# Altium project FMB.PrjPcb
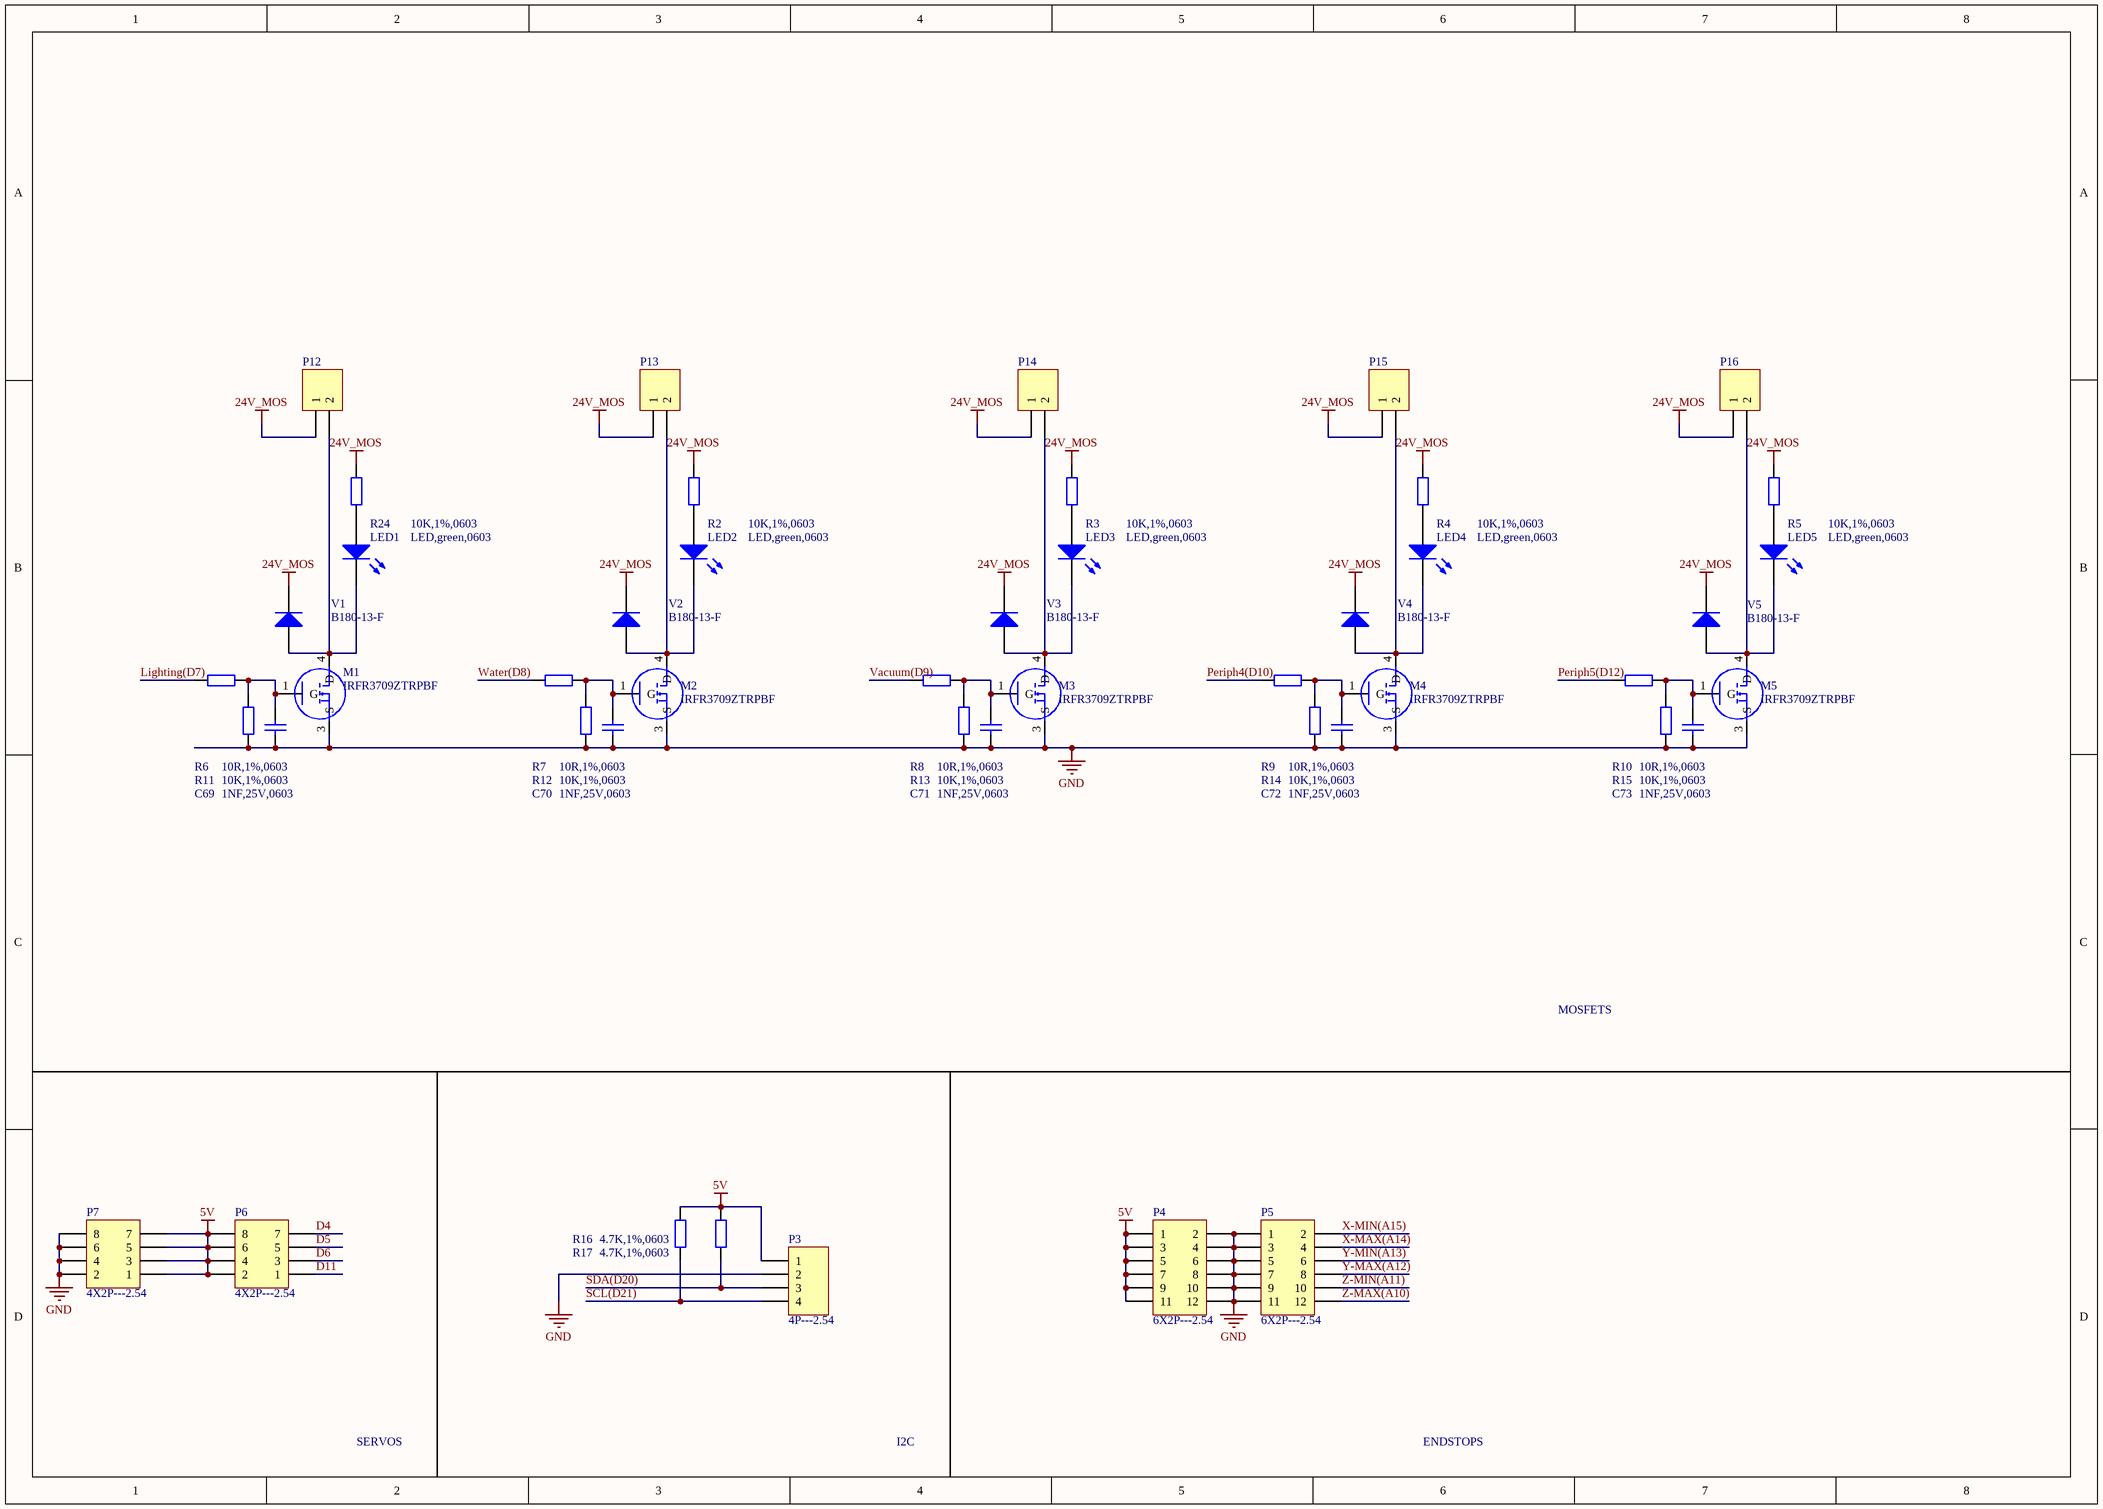
[diagram p0: FMB_MOS.SchDoc]
7 sheets, 272 parts. Net scope: global (net labels, ports and power ports of the same name join across sheets).
Board file: FMB-Farmduino.PcbDoc
Sheets:
  FMB_MOS.SchDoc
  FMB-AB.SchDoc
  FMB-MCU.SchDoc
  FMB-MOTOR.SchDoc
  FMB-POWER.SchDoc
  FMB-STM32.SchDoc
  FMB-USB.SchDoc

## Sheet FMB_MOS.SchDoc
size A3

### Parts
C69  1NF,25V,0603  [RC0603]
C70  1NF,25V,0603  [RC0603]
C71  1NF,25V,0603  [RC0603]
C72  1NF,25V,0603  [RC0603]
C73  1NF,25V,0603  [RC0603]
LED1  LED,green,0603  [LED-0603]
LED2  LED,green,0603  [LED-0603]
LED3  LED,green,0603  [LED-0603]
LED4  LED,green,0603  [LED-0603]
LED5  LED,green,0603  [LED-0603]
M1  IRFR3709ZTRPBF  [DPAK]
M2  IRFR3709ZTRPBF  [DPAK]
M3  IRFR3709ZTRPBF  [DPAK]
M4  IRFR3709ZTRPBF  [DPAK]
M5  IRFR3709ZTRPBF  [DPAK]
P3  4P---2.54  [HDR1X4]
P4  6X2P---2.54  [HDR2X6]
P5  6X2P---2.54  [HDR2X6]
P6  4X2P---2.54  [HDR2X4]
P7  4X2P---2.54  [HDR2X4]
P12  Molex 151048-1206  [151048]  (value not drawn)
P13  Molex 151048-1206  [151048]  (value not drawn)
P14  Molex 151048-1206  [151048]  (value not drawn)
P15  Molex 151048-1206  [151048]  (value not drawn)
P16  Molex 151048-1206  [151048]  (value not drawn)
R2  10K,1%,0603  [RC0603]
R3  10K,1%,0603  [RC0603]
R4  10K,1%,0603  [RC0603]
R5  10K,1%,0603  [RC0603]
R6  10R,1%,0603  [RC0603]
R7  10R,1%,0603  [RC0603]
R8  10R,1%,0603  [RC0603]
R9  10R,1%,0603  [RC0603]
R10  10R,1%,0603  [RC0603]
R11  10K,1%,0603  [RC0603]
R12  10K,1%,0603  [RC0603]
R13  10K,1%,0603  [RC0603]
R14  10K,1%,0603  [RC0603]
R15  10K,1%,0603  [RC0603]
R16  4.7K,1%,0603  [RC0603]
R17  4.7K,1%,0603  [RC0603]
R24  10K,1%,0603  [RC0603]
V1  B180-13-F  [SMA]
V2  B180-13-F  [SMA]
V3  B180-13-F  [SMA]
V4  B180-13-F  [SMA]
V5  B180-13-F  [SMA]

### Nets
5V: P3.1 P4.1 P4.3 P4.5 P4.7 P4.9 P4.11 P6.2 P6.4 P6.6 P6.8 P7.1 P7.3 P7.5 P7.7 R16.2 R17.2
24V_MOS: P12.1 P13.1 P14.1 P15.1 P16.1 R2.1 R3.1 R4.1 R5.1 R24.1 V1.2(K) V2.2(K) V3.2(K) V4.2(K) V5.2(K)  [project net 24V]
GND: C69.1 C70.1 C71.1 C72.1 C73.1 M1.3(S) M2.3(S) M3.3(S) M4.3(S) M5.3(S) P3.2 P4.2 P4.4 P4.6 P4.8 P4.10 P4.12 P5.1 P5.3 P5.5 P5.7 P5.9 P5.11 P7.2 P7.4 P7.6 P7.8 R11.1 R12.1 R13.2 R14.1 R15.1
D4: P6.7
D5: P6.5
D6: P6.3
D11: P6.1
Lighting(D7): R6.1
Periph4(D10): R9.1
Periph5(D12): R10.1
SCL(D21): P3.4 R16.1
SDA(D20): P3.3 R17.1
Vacuum(D9): R8.1
Water(D8): R7.1
X-MAX(A14): P5.4
X-MIN(A15): P5.2
Y-MAX(A12): P5.8
Y-MIN(A13): P5.6
Z-MAX(A10): P5.12
Z-MIN(A11): P5.10
NetC69_2: C69.2 M1.1(G) R6.2 R11.2
NetC70_2: C70.2 M2.1(G) R7.2 R12.2
NetC71_2: C71.2 M3.1(G) R8.2 R13.1
NetC72_2: C72.2 M4.1(G) R9.2 R14.2
NetC73_2: C73.2 M5.1(G) R10.2 R15.2
NetLED1_1: LED1.1(A) R24.2
NetLED1_2: LED1.2(K) M1.4(D) P12.2 V1.1(A)
NetLED2_1: LED2.1(A) R2.2
NetLED2_2: LED2.2(K) M2.4(D) P13.2 V2.1(A)
NetLED3_1: LED3.1(A) R3.2
NetLED3_2: LED3.2(K) M3.4(D) P14.2 V3.1(A)
NetLED4_1: LED4.1(A) R4.2
NetLED4_2: LED4.2(K) M4.4(D) P15.2 V4.1(A)
NetLED5_1: LED5.1(A) R5.2
NetLED5_2: LED5.2(K) M5.4(D) P16.2 V5.1(A)

### Notes on the sheet
- MOSFETS
- SERVOS
- I2C
- ENDSTOPS

### Library data of the parts
C69-C73 = Cap: Capacitor; Value: 100pF; Published: 8-Jun-2000; LatestRevisionDate: 17-Jul-2002; LatestRevisionNote: Re-released for DXP Platform.; PackageReference: RAD-0.3; Publisher: Altium Limited; PackageDescription: Radial Cap, Thru-Hole; 2 Leads; 0.3 in Pin Spacing
LED1-LED5 = LED0: Typical INFRARED GaAs LED; Published: 8-Jun-2000; LatestRevisionDate: 08-Jul-2005; LatestRevisionNote: Mech Layer 1 removed.; PackageReference: LED-0; Publisher: Altium Limited; PackageDescription: LED; 2 Leads
M1-M5 = AP94T07
P3 = Header 4: Header, 4-Pin; LatestRevisionDate: 17-Jul-2002; LatestRevisionNote: Re-released for DXP Platform.; Publisher: Altium Limited
P4 P5 = Header 6X2: Header, 6-Pin, Dual row; LatestRevisionDate: 17-Jul-2002; LatestRevisionNote: Re-released for DXP Platform.; Publisher: Altium Limited
P6 P7 = Header 4X2: Header, 4-Pin, Dual row; LatestRevisionDate: 17-Jul-2002; LatestRevisionNote: Re-released for DXP Platform.; Publisher: Altium Limited
P12-P16 = Header 2: Header, 2-Pin; LatestRevisionDate: 17-Jul-2002; LatestRevisionNote: Re-released for DXP Platform.; Publisher: Altium Limited
R2-R17 R24 = Res2: Resistor; Value: 1K; Published: 8-Jun-2000; LatestRevisionDate: 17-Jul-2002; LatestRevisionNote: Re-released for DXP Platform.; PackageReference: AXIAL-0.4; Publisher: Altium Limited; PackageDescription: Axial Device, Thru-Hole; 2 Leads; 0.4 in Pin Spacing
V1-V5 = Diode: Default Diode; Published: 8-Jun-2000; LatestRevisionDate: 17-Jul-2002; LatestRevisionNote: Re-released for DXP Platform.; PackageVersion: Sep-1996; PackageReference: SMC; Publisher: Altium Limited; PackageDescription: DO-214-AB/SMC; 2 C-Bend Leads; Body 7.9 x 5.9 mm, inc. leads (LxW); Code_JEDEC: DO-214-AB

## Sheet FMB-AB.SchDoc
size A4
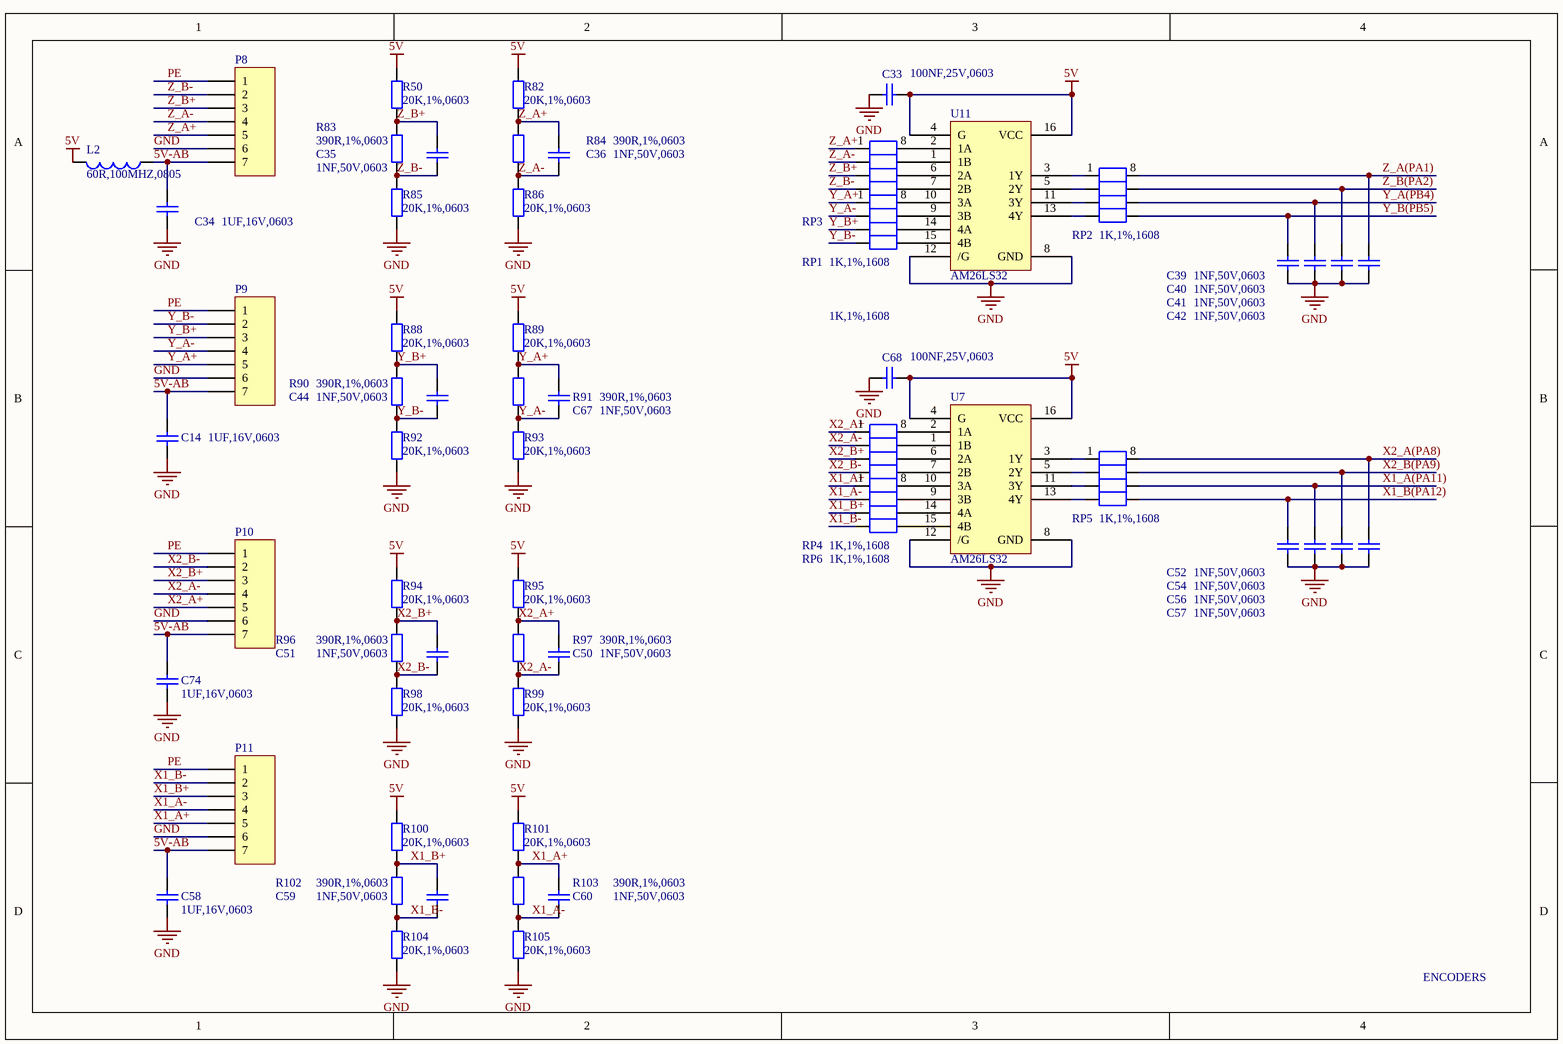
[diagram p1: FMB-AB.SchDoc]

### Parts
C14  1UF,16V,0603  [RC0603]
C33  100NF,25V,0603  [RC0603]
C34  1UF,16V,0603  [RC0603]
C35  1NF,50V,0603  [RC0603]
C36  1NF,50V,0603  [RC0603]
C39  1NF,50V,0603  [RC0603]
C40  1NF,50V,0603  [RC0603]
C41  1NF,50V,0603  [RC0603]
C42  1NF,50V,0603  [RC0603]
C44  1NF,50V,0603  [RC0603]
C50  1NF,50V,0603  [RC0603]
C51  1NF,50V,0603  [RC0603]
C52  1NF,50V,0603  [RC0603]
C54  1NF,50V,0603  [RC0603]
C56  1NF,50V,0603  [RC0603]
C57  1NF,50V,0603  [RC0603]
C58  1UF,16V,0603  [RC0603]
C59  1NF,50V,0603  [RC0603]
C60  1NF,50V,0603  [RC0603]
C67  1NF,50V,0603  [RC0603]
C68  100NF,25V,0603  [RC0603]
C74  1UF,16V,0603  [RC0603]
L2  60R,100MHZ,0805  [RC0805]
P8  Header 7  [DIP-1*7-2.54]  (value not drawn)
P9  Header 7  [DIP-1*7-2.54]  (value not drawn)
P10  Header 7  [DIP-1*7-2.54]  (value not drawn)
P11  Header 7  [DIP-1*7-2.54]  (value not drawn)
R50  20K,1%,0603  [RC0603]
R82  20K,1%,0603  [RC0603]
R83  390R,1%,0603  [RC0603]
R84  390R,1%,0603  [RC0603]
R85  20K,1%,0603  [RC0603]
R86  20K,1%,0603  [RC0603]
R88  20K,1%,0603  [RC0603]
R89  20K,1%,0603  [RC0603]
R90  390R,1%,0603  [RC0603]
R91  390R,1%,0603  [RC0603]
R92  20K,1%,0603  [RC0603]
R93  20K,1%,0603  [RC0603]
R94  20K,1%,0603  [RC0603]
R95  20K,1%,0603  [RC0603]
R96  390R,1%,0603  [RC0603]
R97  390R,1%,0603  [RC0603]
R98  20K,1%,0603  [RC0603]
R99  20K,1%,0603  [RC0603]
R100  20K,1%,0603  [RC0603]
R101  20K,1%,0603  [RC0603]
R102  390R,1%,0603  [RC0603]
R103  390R,1%,0603  [RC0603]
R104  20K,1%,0603  [RC0603]
R105  20K,1%,0603  [RC0603]
RP1  1K,1%,1608  [RP1608]
RP2  1K,1%,1608  [RP1608]
RP3  1K,1%,1608  [RP1608]
RP4  1K,1%,1608  [RP1608]
RP5  1K,1%,1608  [RP1608]
RP6  1K,1%,1608  [RP1608]
U7  AM26LS32  [SO-16-H]
U11  AM26LS32  [SO-16-H]

### Nets
5V: C33.1 C68.1 L2.2 R50.1 R82.1 R88.1 R89.1 R94.1 R95.1 R100.1 R101.1 U7.4(G) U7.16(VCC) U11.4(G) U11.16(VCC)
GND: C14.2 C33.2 C34.2 C39.1 C40.1 C41.1 C42.1 C52.1 C54.1 C56.1 C57.1 C58.2 C68.2 C74.2 P8.6 P9.6 P10.6 P11.6 R85.2 R86.2 R92.2 R93.2 R98.2 R99.2 R104.2 R105.2 U7.8(GND) U7.12(/G) U11.8(GND) U11.12(/G)
5V-AB: C14.1 C34.1 C58.1 C74.1 L2.1 P8.7 P9.7 P10.7 P11.7
PE: P8.1 P9.1 P10.1 P11.1
X1_A(PA11): C52.2 RP5.6
X1_A+: C60.2 P11.5 R101.2 R103.1 RP6.1
X1_A-: C60.1 P11.4 R103.2 R105.1 RP6.2
X1_B(PA12): C54.2 RP5.5
X1_B+: C59.2 P11.3 R100.2 R102.1 RP6.3
X1_B-: C59.1 P11.2 R102.2 R104.1 RP6.4
X2_A(PA8): C57.2 RP5.8
X2_A+: C50.2 P10.5 R95.2 R97.1 RP4.1
X2_A-: C50.1 P10.4 R97.2 R99.1 RP4.2
X2_B(PA9): C56.2 RP5.7
X2_B+: C51.2 P10.3 R94.2 R96.1 RP4.3
X2_B-: C51.1 P10.2 R96.2 R98.1 RP4.4
Y_A(PB4): C39.2 RP2.6
Y_A+: C67.2 P9.5 R89.2 R91.1 RP3.1
Y_A-: C67.1 P9.4 R91.2 R93.1 RP3.2
Y_B(PB5): C40.2 RP2.5
Y_B+: C44.2 P9.3 R88.2 R90.1 RP3.3
Y_B-: C44.1 P9.2 R90.2 R92.1 RP3.4
Z_A(PA1): C42.2 RP2.8
Z_A+: C36.2 P8.5 R82.2 R84.1 RP1.1
Z_A-: C36.1 P8.4 R84.2 R86.1 RP1.2
Z_B(PA2): C41.2 RP2.7
Z_B+: C35.2 P8.3 R50.2 R83.1 RP1.3
Z_B-: C35.1 P8.2 R83.2 R85.1 RP1.4
NetRP1_5: RP1.5 U11.7(2B)
NetRP1_6: RP1.6 U11.6(2A)
NetRP1_7: RP1.7 U11.1(1B)
NetRP1_8: RP1.8 U11.2(1A)
NetRP2_1: RP2.1 U11.3(1Y)
NetRP2_2: RP2.2 U11.5(2Y)
NetRP2_3: RP2.3 U11.11(3Y)
NetRP2_4: RP2.4 U11.13(4Y)
NetRP3_5: RP3.5 U11.15(4B)
NetRP3_6: RP3.6 U11.14(4A)
NetRP3_7: RP3.7 U11.9(3B)
NetRP3_8: RP3.8 U11.10(3A)
NetRP4_5: RP4.5 U7.7(2B)
NetRP4_6: RP4.6 U7.6(2A)
NetRP4_7: RP4.7 U7.1(1B)
NetRP4_8: RP4.8 U7.2(1A)
NetRP5_1: RP5.1 U7.3(1Y)
NetRP5_2: RP5.2 U7.5(2Y)
NetRP5_3: RP5.3 U7.11(3Y)
NetRP5_4: RP5.4 U7.13(4Y)
NetRP6_5: RP6.5 U7.15(4B)
NetRP6_6: RP6.6 U7.14(4A)
NetRP6_7: RP6.7 U7.9(3B)
NetRP6_8: RP6.8 U7.10(3A)

### Notes on the sheet
- ENCODERS

### Library data of the parts
C14 C33-C36 C39-C42 C44 C50-C52 C54 C56-C60 C67 C68 C74 = Cap: Capacitor; Value: 100pF; Published: 8-Jun-2000; LatestRevisionDate: 17-Jul-2002; LatestRevisionNote: Re-released for DXP Platform.; PackageReference: RAD-0.3; Publisher: Altium Limited; PackageDescription: Radial Cap, Thru-Hole; 2 Leads; 0.3 in Pin Spacing
L2 = Inductor: Code_IEC: 1005; Value: 10mH; Published: 8-Jun-2000; LatestRevisionDate: 29-May-2009; LatestRevisionNote: IPC-7351 Footprint Added.; PackageReference: 0402-A; Publisher: Altium Limited; PackageDescription: Chip Inductor; Code_JEITA: 0402
P8-P11 = Header 7: Header, 7-Pin; LatestRevisionDate: 17-Jul-2002; LatestRevisionNote: Re-released for DXP Platform.; Publisher: Altium Limited
R50 R82-R86 R88-R105 = Res2: Resistor; Value: 1K; Published: 8-Jun-2000; LatestRevisionDate: 17-Jul-2002; LatestRevisionNote: Re-released for DXP Platform.; PackageReference: AXIAL-0.4; Publisher: Altium Limited; PackageDescription: Axial Device, Thru-Hole; 2 Leads; 0.4 in Pin Spacing
RP1-RP6 = RP1608-1

## Sheet FMB-MCU.SchDoc
size A3
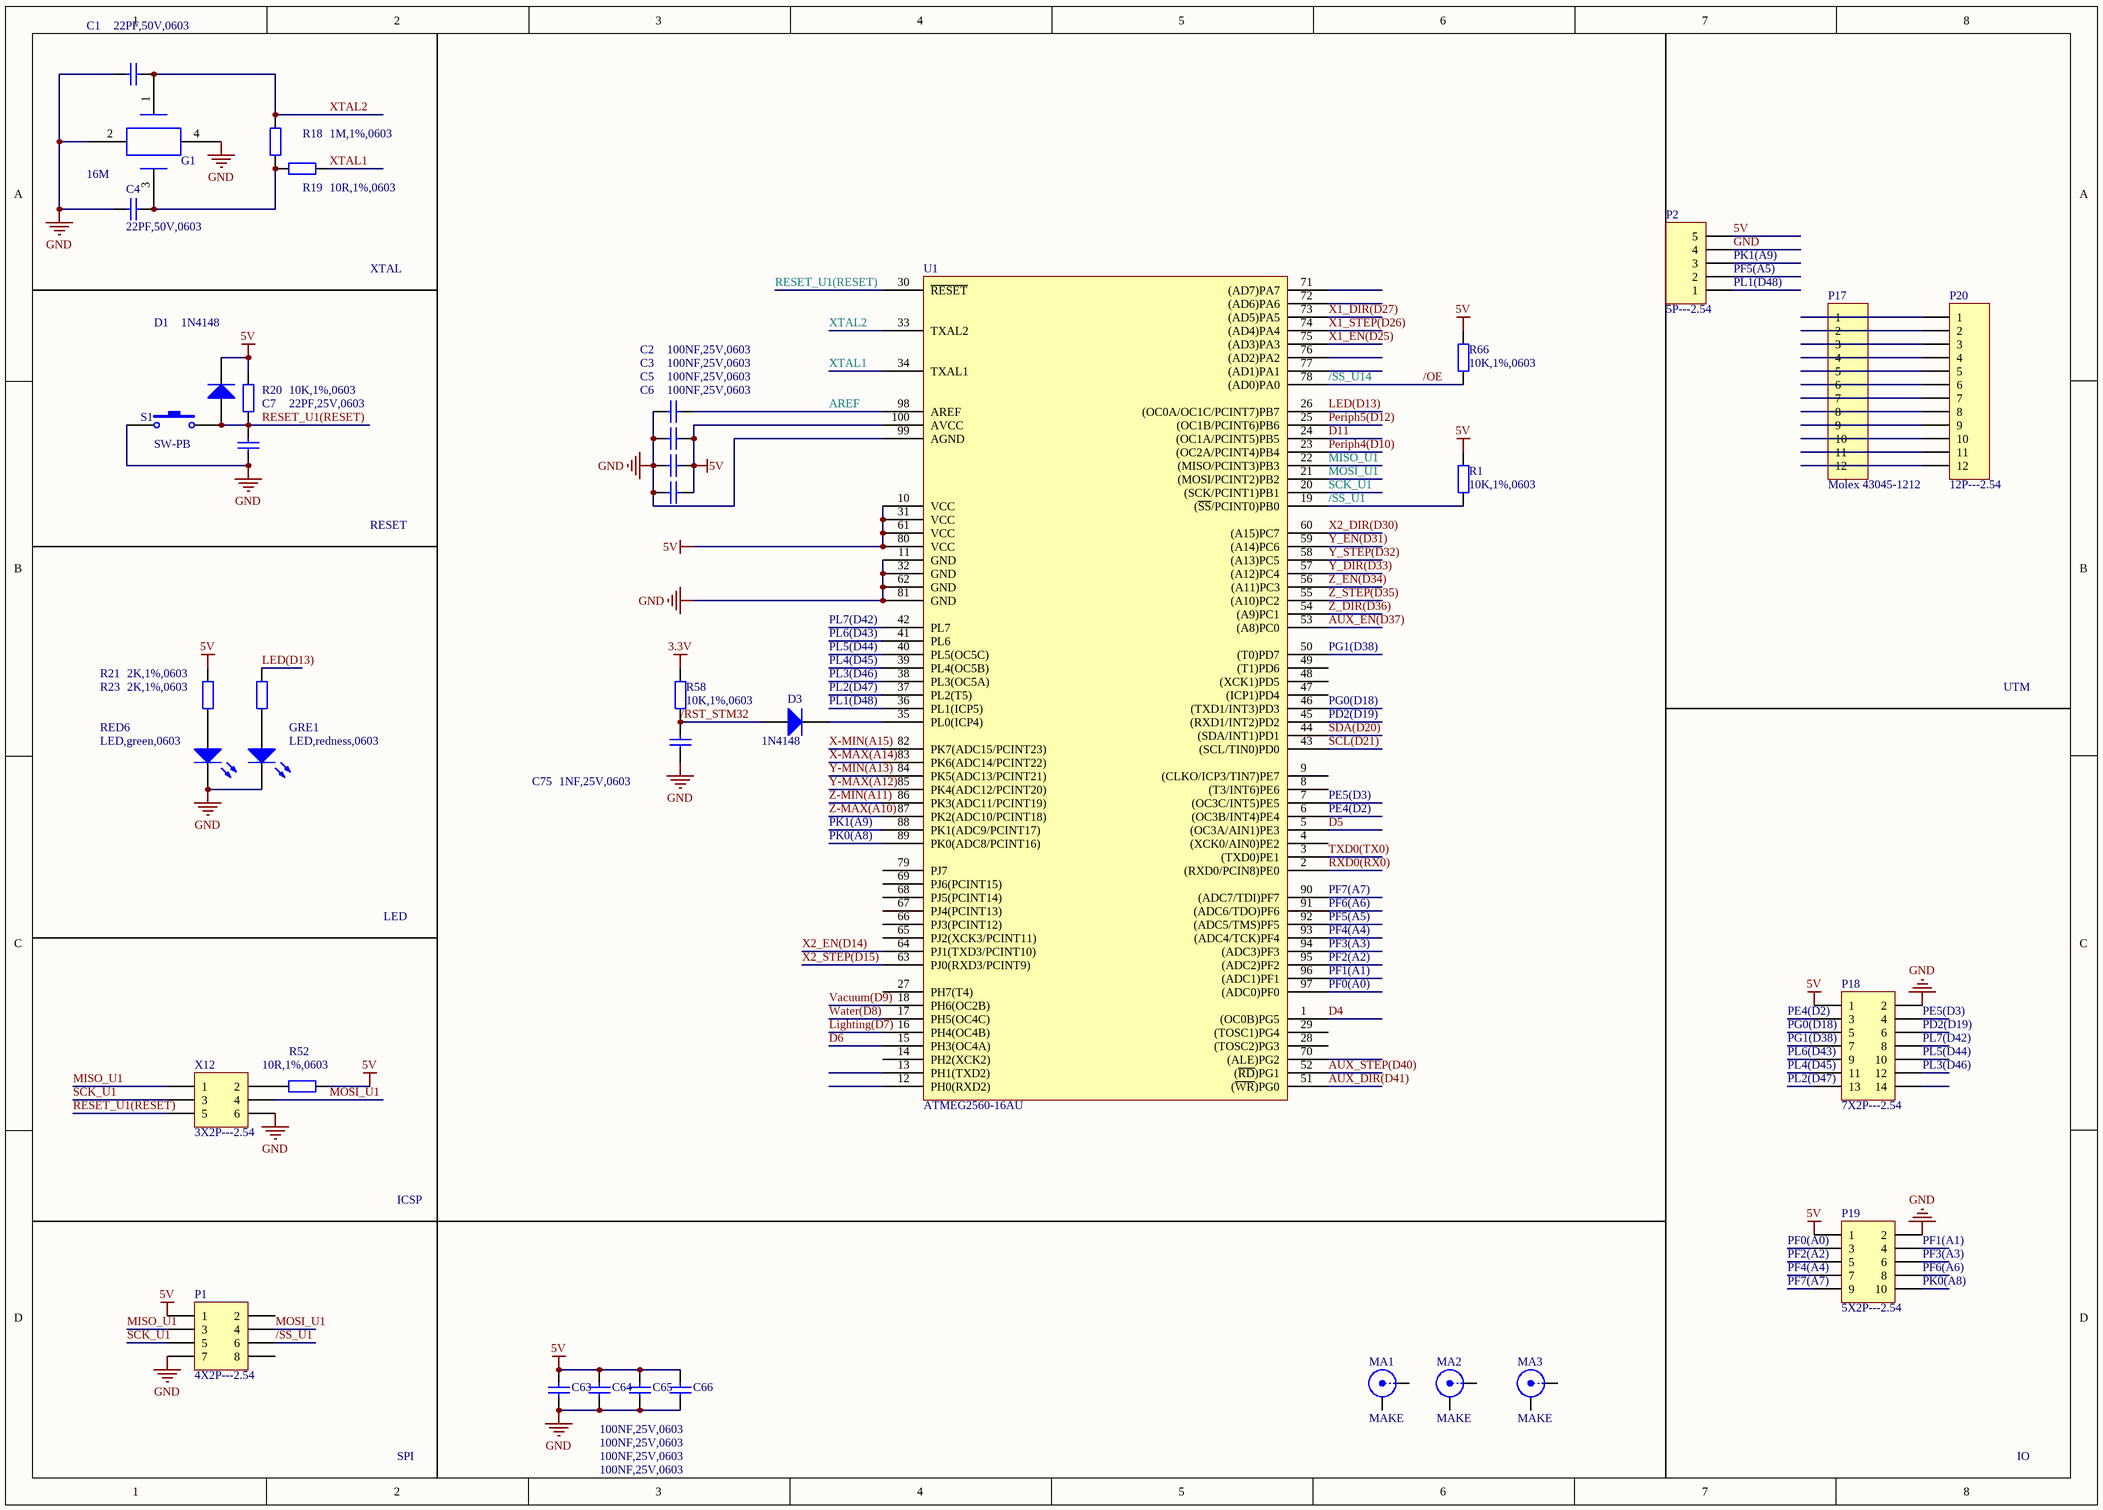
[diagram p2: FMB-MCU.SchDoc]

### Parts
C1  22PF,50V,0603  [RC0603]
C2  100NF,25V,0603  [RC0603]
C3  100NF,25V,0603  [RC0603]
C4  22PF,50V,0603  [RC0603]
C5  100NF,25V,0603  [RC0603]
C6  100NF,25V,0603  [RC0603]
C7  22PF,25V,0603  [RC0603]
C63  100NF,25V,0603  [RC0603]
C64  100NF,25V,0603  [RC0603]
C65  100NF,25V,0603  [RC0603]
C66  100NF,25V,0603  [RC0603]
C75  1NF,25V,0603  [RC0603]
D1  1N4148  [SOD-323]
D3  1N4148  [SOD-323]
G1  16M  [Y-3225]
GRE1  LED,redness,0603  [LED-0603]
MA1  MAKE
MA2  MAKE
MA3  MAKE
P1  4X2P---2.54  [HDR2X4]
P2  5P---2.54  [HDR1X5]
P17  Molex 43045-1212  [43045-1212]
P18  7X2P---2.54  [HDR2X7]
P19  5X2P---2.54  [HDR2X5]
P20  12P---2.54  [HDR1X12]
R1  10K,1%,0603  [RC0603]
R18  1M,1%,0603  [RC0603]
R19  10R,1%,0603  [RC0603]
R20  10K,1%,0603  [RC0603]
R21  2K,1%,0603  [RC0603]
R23  2K,1%,0603  [RC0603]
R52  10R,1%,0603  [RC0603]
R58  10K,1%,0603  [RC0603]
R66  10K,1%,0603  [RC0603]
RED6  LED,green,0603  [LED-0603]
S1  SW-PB  [DIP6*6]
U1  ATMEG2560-16AU  [LQFP-100]
X12  3X2P---2.54  [HDR2X3]

### Nets
3.3V: R58.1
5V: C3.1 C5.1 C6.1 C63.1 C64.1 C65.1 C66.1 D1.2(K) P1.1 P2.5 P18.1 P19.1 R1.2 R20.1 R23.1 R52.1 R66.2 U1.10(VCC) U1.31(VCC) U1.61(VCC) U1.80(VCC) U1.100(AVCC)
GND: C1.2 C2.2 C3.2 C4.1 C5.2 C6.2 C7.2 C63.2 C64.2 C65.2 C66.2 C75.1 G1.2 G1.4 GRE1.2(K) P1.7 P2.4 P18.2 P19.2 RED6.2(K) S1.1 U1.11(GND) U1.32(GND) U1.62(GND) U1.81(GND) U1.99(AGND) X12.6
/OE: R66.1 U1.78((AD0)PA0)  [also labelled /SS_U14]
/RST_STM32: C75.2 D3.1(A) R58.2
/SS_U1: P1.6 R1.1 U1.19((~{SS}/PCINT0)PB0)
AREF: C2.1 U1.98(AREF)
AUX_DIR(D41): U1.51((~{WR})PG0)
AUX_EN(D37): U1.53((A8)PC0)
AUX_STEP(D40): U1.52((~{RD})PG1)
D4: U1.1((OC0B)PG5)
D5: U1.5((OC3A/AIN1)PE3)
D6: U1.15(PH3(OC4A))
D11: U1.24((OC1A/PCINT5)PB5)
LED(D13): R21.1 U1.26((OC0A/OC1C/PCINT7)PB7)
Lighting(D7): U1.16(PH4(OC4B))
MISO_U1: P1.3 U1.22((MISO/PCINT3)PB3) X12.1
MOSI_U1: P1.4 U1.21((MOSI/PCINT2)PB2) X12.4
PD2(D19): P18.6 U1.45((RXD1/INT2)PD2)
PE4(D2): P18.3 U1.6((OC3B/INT4)PE4)
PE5(D3): P18.4 U1.7((OC3C/INT5)PE5)
Periph4(D10): U1.23((OC2A/PCINT4)PB4)
Periph5(D12): U1.25((OC1B/PCINT6)PB6)
PF0(A0): P19.3 U1.97((ADC0)PF0)
PF1(A1): P19.4 U1.96((ADC1)PF1)
PF2(A2): P19.5 U1.95((ADC2)PF2)
PF3(A3): P19.6 U1.94((ADC3)PF3)
PF4(A4): P19.7 U1.93((ADC4/TCK)PF4)
PF5(A5): P2.2 U1.92((ADC5/TMS)PF5)
PF6(A6): P19.8 U1.91((ADC6/TDO)PF6)
PF7(A7): P19.9 U1.90((ADC7/TDI)PF7)
PG0(D18): P18.5 U1.46((TXD1/INT3)PD3)
PG1(D38): P18.7 U1.50((T0)PD7)
PK0(A8): P19.10 U1.89(PK0(ADC8/PCINT16))
PK1(A9): P2.3 U1.88(PK1(ADC9/PCINT17))
PL1(D48): P2.1 U1.36(PL1(ICP5))
PL2(D47): P18.13 U1.37(PL2(T5))
PL3(D46): P18.12 U1.38(PL3(OC5A))
PL4(D45): P18.11 U1.39(PL4(OC5B))
PL5(D44): P18.10 U1.40(PL5(OC5C))
PL6(D43): P18.9 U1.41(PL6)
PL7(D42): P18.8 U1.42(PL7)
RESET_U1(RESET): C7.1 D1.1(A) R20.2 S1.2 U1.30(~{RESET}) X12.5
RXD0(RX0): U1.2((RXD0/PCIN8)PE0)
SCK_U1: P1.5 U1.20((SCK/PCINT1)PB1) X12.3
SCL(D21): U1.43((SCL/TIN0)PD0)
SDA(D20): U1.44((SDA/INT1)PD1)
TXD0(TX0): U1.3((TXD0)PE1)
Vacuum(D9): U1.18(PH6(OC2B))
Water(D8): U1.17(PH5(OC4C))
X1_DIR(D27): U1.73((AD5)PA5)
X1_EN(D25): U1.75((AD3)PA3)
X1_STEP(D26): U1.74((AD4)PA4)
X2_DIR(D30): U1.60((A15)PC7)
X2_EN(D14): U1.64(PJ1(TXD3/PCINT10))
X2_STEP(D15): U1.63(PJ0(RXD3/PCINT9))
X-MAX(A14): U1.83(PK6(ADC14/PCINT22))
X-MIN(A15): U1.82(PK7(ADC15/PCINT23))
XTAL1: R19.2 U1.34(TXAL1)
XTAL2: C1.1 G1.1 R18.1 U1.33(TXAL2)
Y-MAX(A12): U1.85(PK4(ADC12/PCINT20))
Y-MIN(A13): U1.84(PK5(ADC13/PCINT21))
Y_DIR(D33): U1.57((A12)PC4)
Y_EN(D31): U1.59((A14)PC6)
Y_STEP(D32): U1.58((A13)PC5)
Z-MAX(A10): U1.87(PK2(ADC10/PCINT18))
Z-MIN(A11): U1.86(PK3(ADC11/PCINT19))
Z_DIR(D36): U1.54((A9)PC1)
Z_EN(D34): U1.56((A11)PC3)
Z_STEP(D35): U1.55((A10)PC2)
NetC4_2: C4.2 G1.3 R18.2 R19.1
NetD3_2: D3.2(K) U1.35(PL0(ICP4))
NetGRE1_1: GRE1.1(A) R21.2
NetP17_1: P17.1 P20.1
NetP17_2: P17.2 P20.2
NetP17_3: P17.3 P20.3
NetP17_4: P17.4 P20.4
NetP17_5: P17.5 P20.5
NetP17_6: P17.6 P20.6
NetP17_7: P17.7 P20.7
NetP17_8: P17.8 P20.8
NetP17_9: P17.9 P20.9
NetP17_10: P17.10 P20.10
NetP17_11: P17.11 P20.11
NetP17_12: P17.12 P20.12
NetR23_2: R23.2 RED6.1(A)
NetR52_2: R52.2 X12.2

Not connected (* = marked no-connect by the designer): MA1 1(X) 2(Y); MA2 1(X) 2(Y); MA3 1(X) 2(Y); P1 2 8; P18 14; U1 4((XCK0/AIN0)PE2) 8((T3/INT6)PE6) 9((CLKO/ICP3/TIN7)PE7) 12(PH0(RXD2)) 13(PH1(TXD2)) 14(PH2(XCK2)) 27(PH7(T4)) 28((TOSC2)PG3) 29((TOSC1)PG4) 47((ICP1)PD4) 48((XCK1)PD5) 49((T1)PD6) 65(PJ2(XCK3/PCINT11)) 66(PJ3(PCINT12)) 67(PJ4(PCINT13)) 68(PJ5(PCINT14)) 69(PJ6(PCINT15)) 70((ALE)PG2) 71((AD7)PA7) 72((AD6)PA6) 76((AD2)PA2) 77((AD1)PA1) 79(PJ7)

### Notes on the sheet
- XTAL
- RESET
- UTM
- LED
- ICSP
- SPI
- IO

### Library data of the parts
C1-C7 C63-C66 C75 = Cap: Capacitor; Value: 100pF; Published: 8-Jun-2000; LatestRevisionDate: 17-Jul-2002; LatestRevisionNote: Re-released for DXP Platform.; PackageReference: RAD-0.3; Publisher: Altium Limited; PackageDescription: Radial Cap, Thru-Hole; 2 Leads; 0.3 in Pin Spacing
D1 D3 = Diode: Default Diode; Published: 8-Jun-2000; LatestRevisionDate: 17-Jul-2002; LatestRevisionNote: Re-released for DXP Platform.; PackageVersion: Sep-1996; PackageReference: SMC; Publisher: Altium Limited; PackageDescription: DO-214-AB/SMC; 2 C-Bend Leads; Body 7.9 x 5.9 mm, inc. leads (LxW); Code_JEDEC: DO-214-AB
G1 = G
GRE1 RED6 = LED0: Typical INFRARED GaAs LED; Published: 8-Jun-2000; LatestRevisionDate: 08-Jul-2005; LatestRevisionNote: Mech Layer 1 removed.; PackageReference: LED-0; Publisher: Altium Limited; PackageDescription: LED; 2 Leads
MA1-MA3 = BNC: BNC Elbow Connector; LatestRevisionDate: 17-Jul-2002; LatestRevisionNote: Re-released for DXP Platform.; Publisher: Altium Limited
P1 = Header 4X2: Header, 4-Pin, Dual row; LatestRevisionDate: 17-Jul-2002; LatestRevisionNote: Re-released for DXP Platform.; Publisher: Altium Limited
P2 = Header 5: Header, 5-Pin; LatestRevisionDate: 17-Jul-2002; LatestRevisionNote: Re-released for DXP Platform.; Publisher: Altium Limited
P17 P20 = Header 12: Header, 12-Pin; LatestRevisionDate: 17-Jul-2002; LatestRevisionNote: Re-released for DXP Platform.; Publisher: Altium Limited
P18 = Header 7X2: Header, 7-Pin, Dual row; LatestRevisionDate: 17-Jul-2002; LatestRevisionNote: Re-released for DXP Platform.; Publisher: Altium Limited
P19 = Header 5X2: Header, 5-Pin, Dual row; LatestRevisionDate: 17-Jul-2002; LatestRevisionNote: Re-released for DXP Platform.; Publisher: Altium Limited
R1 R18-R21 R23 R52 R58 R66 = Res2: Resistor; Value: 1K; Published: 8-Jun-2000; LatestRevisionDate: 17-Jul-2002; LatestRevisionNote: Re-released for DXP Platform.; PackageReference: AXIAL-0.4; Publisher: Altium Limited; PackageDescription: Axial Device, Thru-Hole; 2 Leads; 0.4 in Pin Spacing
S1 = SW-PB: Switch; Published: 24-Mar-1999; LatestRevisionDate: 17-Jul-2002; LatestRevisionNote: Re-released for DXP Platform.; PackageReference: SPST-2; Publisher: Altium Limited; PackageDescription: Switch; 2 Leads
X12 = Header 3X2: Header, 3-Pin, Dual row; LatestRevisionDate: 17-Jul-2002; LatestRevisionNote: Re-released for DXP Platform.; Publisher: Altium Limited

## Sheet FMB-MOTOR.SchDoc
size A4
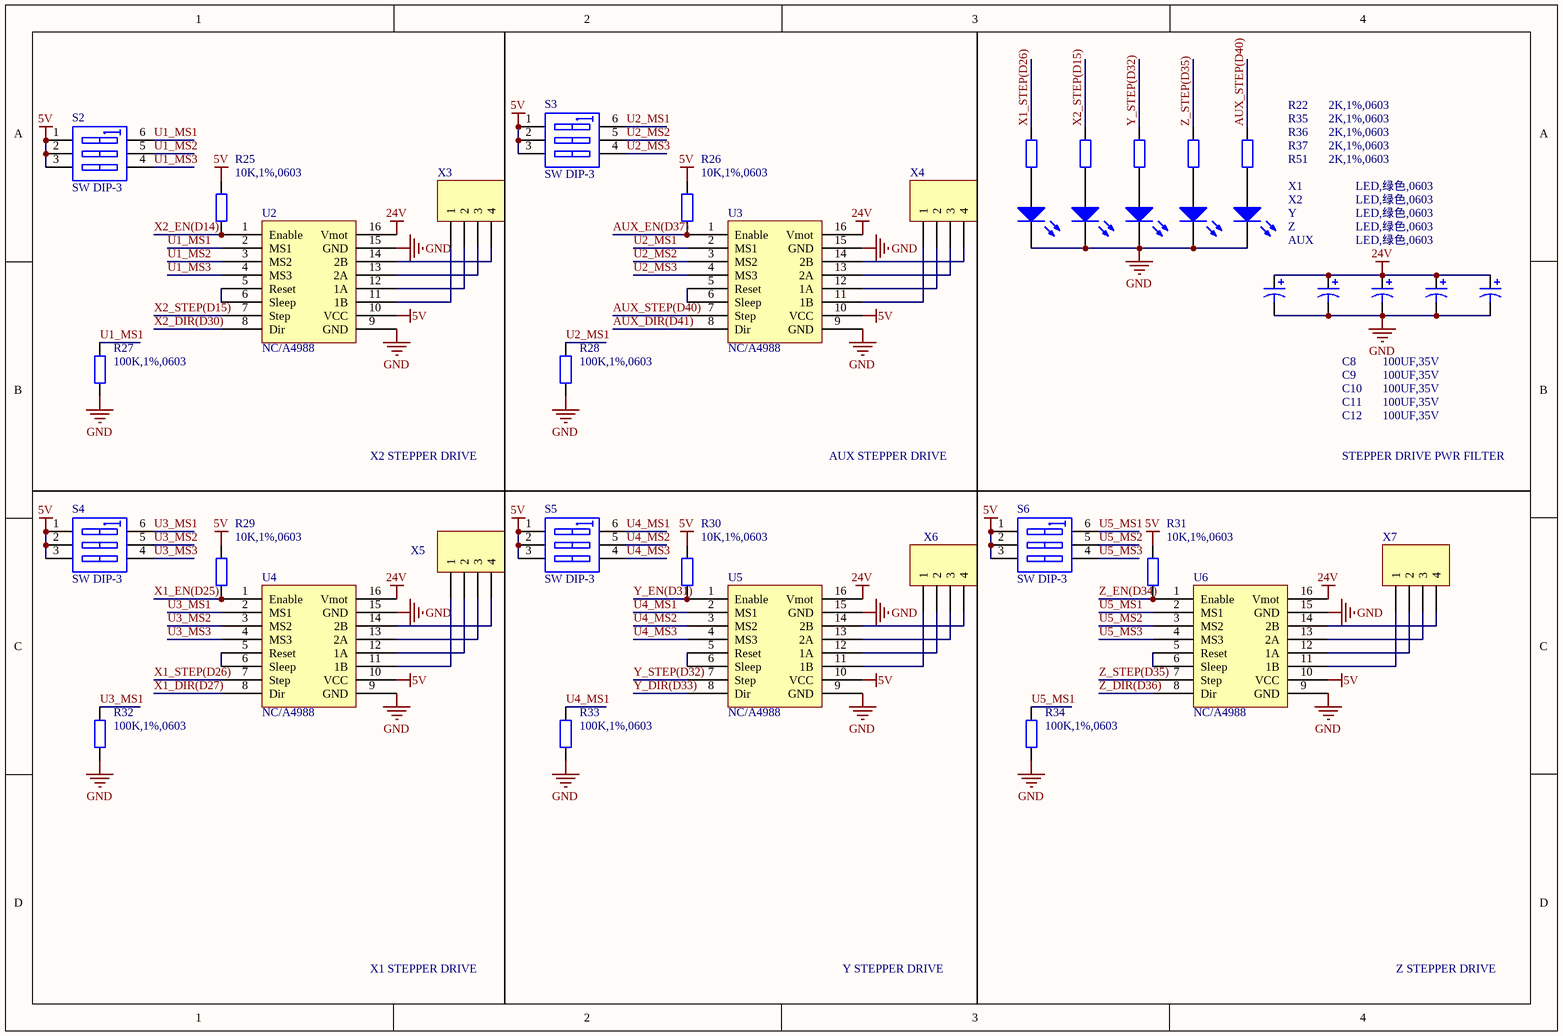
[diagram p3: FMB-MOTOR.SchDoc]

### Parts
AUX  LED,绿色,0603  [LED-0603]
C8  100UF,35V  [EC-5X5.3]
C9  100UF,35V  [EC-5X5.3]
C10  100UF,35V  [EC-5X5.3]
C11  100UF,35V  [EC-5X5.3]
C12  100UF,35V  [EC-5X5.3]
R22  2K,1%,0603  [RC0603]
R25  10K,1%,0603  [RC0603]
R26  10K,1%,0603  [RC0603]
R27  100K,1%,0603  [RC0603]
R28  100K,1%,0603  [RC0603]
R29  10K,1%,0603  [RC0603]
R30  10K,1%,0603  [RC0603]
R31  10K,1%,0603  [RC0603]
R32  100K,1%,0603  [RC0603]
R33  100K,1%,0603  [RC0603]
R34  100K,1%,0603  [RC0603]
R35  2K,1%,0603  [RC0603]
R36  2K,1%,0603  [RC0603]
R37  2K,1%,0603  [RC0603]
R51  2K,1%,0603  [RC0603]
S2  SW DIP-3  [DIP-3-SW]
S3  SW DIP-3  [DIP-3-SW]
S4  SW DIP-3  [DIP-3-SW]
S5  SW DIP-3  [DIP-3-SW]
S6  SW DIP-3  [DIP-3-SW]
U2  NC/A4988  [A4988]
U3  NC/A4988  [A4988]
U4  NC/A4988  [A4988]
U5  NC/A4988  [A4988]
U6  NC/A4988  [A4988]
X1  LED,绿色,0603  [LED-0603]
X2  LED,绿色,0603  [LED-0603]
X3  Molex 70543-0038  [DIP-1*4-2.54]  (value not drawn)
X4  Molex 70543-0038  [DIP-1*4-2.54]  (value not drawn)
X5  Molex 70543-0038  [DIP-1*4-2.54]  (value not drawn)
X6  Molex 70543-0038  [DIP-1*4-2.54]  (value not drawn)
X7  Molex 70543-0038  [DIP-1*4-2.54]  (value not drawn)
Y  LED,绿色,0603  [LED-0603]
Z  LED,绿色,0603  [LED-0603]

### Nets
5V: R25.1 R26.1 R29.1 R30.1 R31.1 S2.1(A1) S2.2(A2) S2.3(A3) S3.1(A1) S3.2(A2) S3.3(A3) S4.1(A1) S4.2(A2) S4.3(A3) S5.1(A1) S5.2(A2) S5.3(A3) S6.1(A1) S6.2(A2) S6.3(A3) U2.10(VCC) U3.10(VCC) U4.10(VCC) U5.10(VCC) U6.10(VCC)
24V: C8.1 C9.1 C10.1 C11.1 C12.1 U2.16(Vmot) U3.16(Vmot) U4.16(Vmot) U5.16(Vmot) U6.16(Vmot)
GND: AUX.2(K) C8.2 C9.2 C10.2 C11.2 C12.2 R27.2 R28.2 R32.2 R33.2 R34.2 U2.9(GND) U2.15(GND) U3.9(GND) U3.15(GND) U4.9(GND) U4.15(GND) U5.9(GND) U5.15(GND) U6.9(GND) U6.15(GND) X1.2(K) X2.2(K) Y.2(K) Z.2(K)
AUX_DIR(D41): U3.8(Dir)
AUX_EN(D37): R26.2 U3.1(Enable)
AUX_STEP(D40): R51.1 U3.7(Step)
U1_MS1: R27.1 S2.6(B1) U2.2(MS1)
U1_MS2: S2.5(B2) U2.3(MS2)
U1_MS3: S2.4(B3) U2.4(MS3)
U2_MS1: R28.1 S3.6(B1) U3.2(MS1)
U2_MS2: S3.5(B2) U3.3(MS2)
U2_MS3: S3.4(B3) U3.4(MS3)
U3_MS1: R32.1 S4.6(B1) U4.2(MS1)
U3_MS2: S4.5(B2) U4.3(MS2)
U3_MS3: S4.4(B3) U4.4(MS3)
U4_MS1: R33.1 S5.6(B1) U5.2(MS1)
U4_MS2: S5.5(B2) U5.3(MS2)
U4_MS3: S5.4(B3) U5.4(MS3)
U5_MS1: R34.1 S6.6(B1) U6.2(MS1)
U5_MS2: S6.5(B2) U6.3(MS2)
U5_MS3: S6.4(B3) U6.4(MS3)
X1_DIR(D27): U4.8(Dir)
X1_EN(D25): R29.2 U4.1(Enable)
X1_STEP(D26): R22.1 U4.7(Step)
X2_DIR(D30): U2.8(Dir)
X2_EN(D14): R25.2 U2.1(Enable)
X2_STEP(D15): R35.1 U2.7(Step)
Y_DIR(D33): U5.8(Dir)
Y_EN(D31): R30.2 U5.1(Enable)
Y_STEP(D32): R36.1 U5.7(Step)
Z_DIR(D36): U6.8(Dir)
Z_EN(D34): R31.2 U6.1(Enable)
Z_STEP(D35): R37.1 U6.7(Step)
NetAUX_1: AUX.1(A) R51.2
NetR22_2: R22.2 X1.1(A)
NetR35_2: R35.2 X2.1(A)
NetR36_2: R36.2 Y.1(A)
NetR37_2: R37.2 Z.1(A)
NetU2_5: U2.5(Reset) U2.6(Sleep)
NetU2_11: U2.11(1B) X3.1
NetU2_12: U2.12(1A) X3.2
NetU2_13: U2.13(2A) X3.3
NetU2_14: U2.14(2B) X3.4
NetU3_5: U3.5(Reset) U3.6(Sleep)
NetU3_11: U3.11(1B) X4.1
NetU3_12: U3.12(1A) X4.2
NetU3_13: U3.13(2A) X4.3
NetU3_14: U3.14(2B) X4.4
NetU4_5: U4.5(Reset) U4.6(Sleep)
NetU4_11: U4.11(1B) X5.1
NetU4_12: U4.12(1A) X5.2
NetU4_13: U4.13(2A) X5.3
NetU4_14: U4.14(2B) X5.4
NetU5_5: U5.5(Reset) U5.6(Sleep)
NetU5_11: U5.11(1B) X6.1
NetU5_12: U5.12(1A) X6.2
NetU5_13: U5.13(2A) X6.3
NetU5_14: U5.14(2B) X6.4
NetU6_5: U6.5(Reset) U6.6(Sleep)
NetU6_11: U6.11(1B) X7.1
NetU6_12: U6.12(1A) X7.2
NetU6_13: U6.13(2A) X7.3
NetU6_14: U6.14(2B) X7.4

### Notes on the sheet
- X2 STEPPER DRIVE
- AUX STEPPER DRIVE
- STEPPER DRIVE PWR FILTER
- X1 STEPPER DRIVE
- Y STEPPER DRIVE
- Z STEPPER DRIVE

### Library data of the parts
AUX X1 X2 Y Z = LED0: Typical INFRARED GaAs LED; Published: 8-Jun-2000; LatestRevisionDate: 08-Jul-2005; LatestRevisionNote: Mech Layer 1 removed.; PackageReference: LED-0; Publisher: Altium Limited; PackageDescription: LED; 2 Leads
C8-C12 = Cap Pol3: Polarized Capacitor (Surface Mount); Value: 100pF; Published: 8-Jun-2000; LatestRevisionDate: 29-May-2009; LatestRevisionNote: IPC-7351 Footprint Added.; PackageReference: C0805; Publisher: Altium Limited; PackageDescription: Chip Capacitor
R22 R25-R37 R51 = Res2: Resistor; Value: 1K; Published: 8-Jun-2000; LatestRevisionDate: 17-Jul-2002; LatestRevisionNote: Re-released for DXP Platform.; PackageReference: AXIAL-0.4; Publisher: Altium Limited; PackageDescription: Axial Device, Thru-Hole; 2 Leads; 0.4 in Pin Spacing
S2-S6 = SW DIP-3: DIP Switch, 3 Position, SPST; Published: 24-Mar-1999; LatestRevisionDate: 17-Jul-2002; LatestRevisionNote: Re-released for DXP Platform.; PackageReference: DIP-6; Publisher: Altium Limited; Code_JEDEC: MO-001-AM
U2-U6 = A4988
X3-X7 = Header 4: Header, 4-Pin; LatestRevisionDate: 17-Jul-2002; LatestRevisionNote: Re-released for DXP Platform.; Publisher: Altium Limited

## Sheet FMB-POWER.SchDoc
size A4
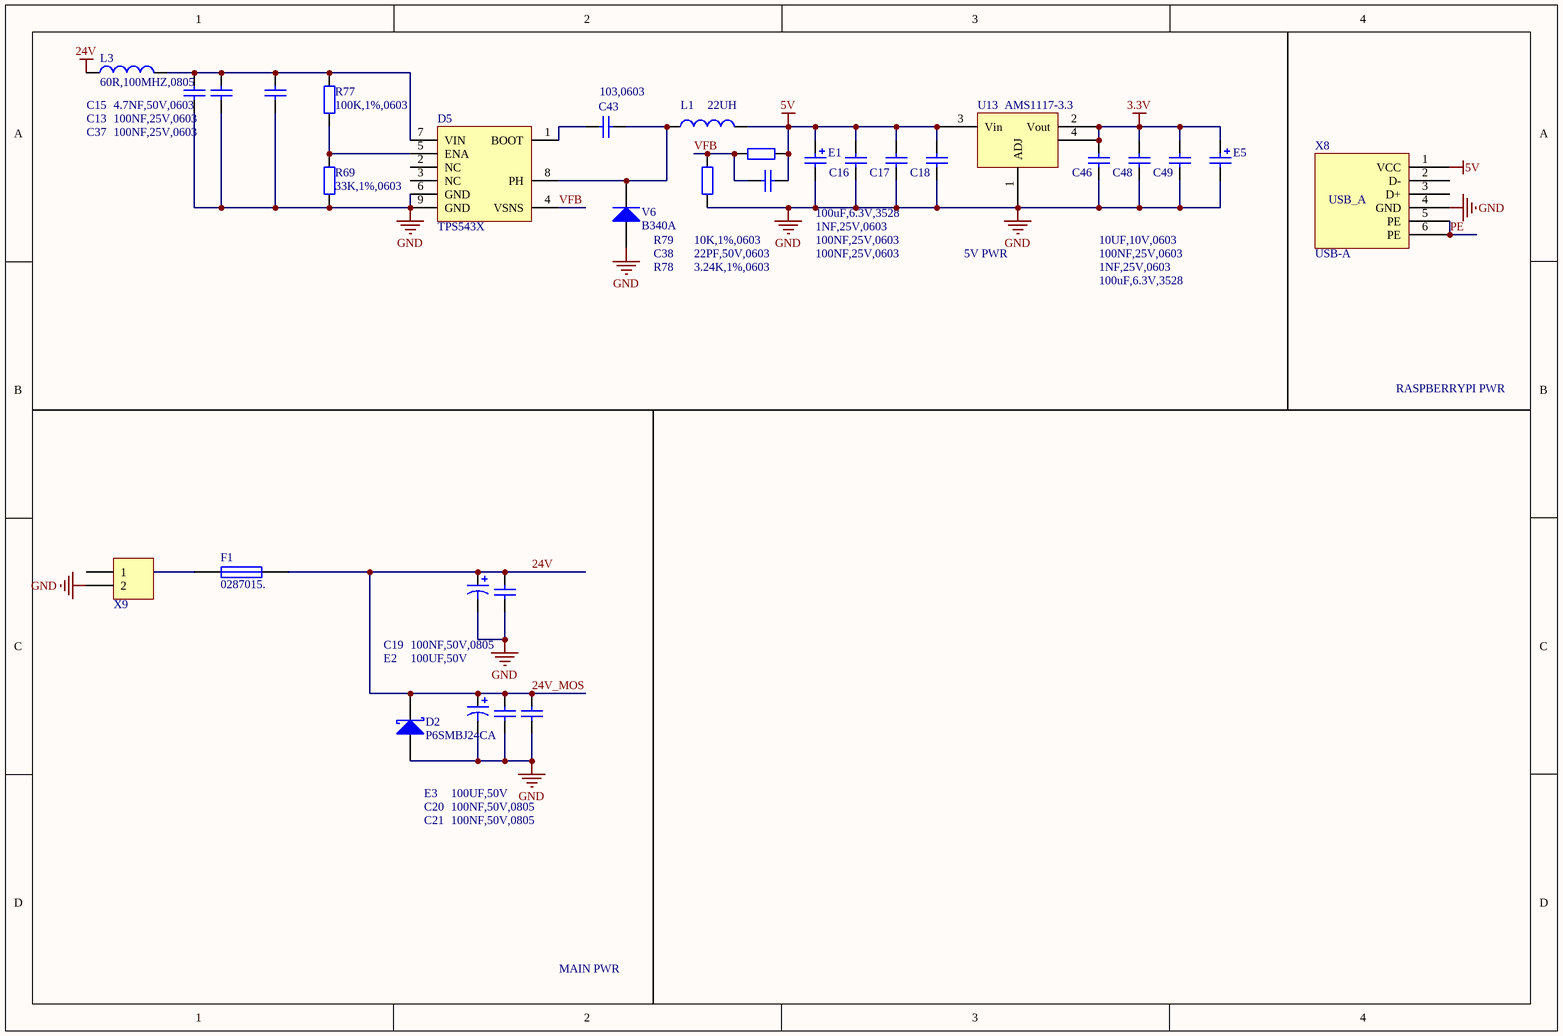
[diagram p4: FMB-POWER.SchDoc]

### Parts
C13  100NF,25V,0603  [RC0603]
C15  4.7NF,50V,0603  [RC0603]
C16  1NF,25V,0603  [RC0603]
C17  100NF,25V,0603  [RC0603]
C18  100NF,25V,0603  [RC0603]
C19  100NF,50V,0805  [RC0805]
C20  100NF,50V,0805  [RC0805]
C21  100NF,50V,0805  [RC0805]
C37  100NF,25V,0603  [RC0603]
C38  22PF,50V,0603  [RC0603]
C43  103,0603  [RC0603]
C46  100NF,25V,0603  [RC0603]
C48  10UF,10V,0603  [RC0603]
C49  1NF,25V,0603  [RC0603]
D2  P6SMBJ24CA  [SMB]
D5  TPS543X  [SO-8-1]
E1  100uF,6.3V,3528  [3528-21]
E2  100UF,50V  [RB-.2X.4]
E3  100UF,50V  [RB-.2X.4]
E5  value 100uF,6.3V,3528
F1  0287015.  [GF-C40]
L1  22UH  [L7*7]
L3  60R,100MHZ,0805  [RC0805]
R69  33K,1%,0603  [RC0603]
R77  100K,1%,0603  [RC0603]
R78  3.24K,1%,0603  [RC0603]
R79  10K,1%,0603  [RC0603]
U13  AMS1117-3.3  [SOT-223]
V6  B340A  [SMA]
X8  USB-A  [USB-A180]
X9  Molex 151048-1206  [151048]  (value not drawn)

### Nets
3.3V: C46.2 C48.2 C49.2 E5.1 U13.2(Vout) U13.4
5V: C16.2 C17.2 C18.2 C38.1 E1.1 L1.2 R79.2 U13.3(Vin) X8.1(VCC)
24V: C19.1 C20.1 C21.1 D2.2(K) E2.1 E3.1 F1.1 L3.1  [also labelled 24V_MOS]
GND: C13.2 C15.1 C16.1 C17.1 C18.1 C19.2 C20.2 C21.2 C37.2 C46.1 C48.1 C49.1 D2.1(A) D5.6(GND) D5.9(GND) E1.2 E2.2 E3.2 E5.2 R69.2 R78.2 U13.1(ADJ) V6.1(A) X8.4(GND) X9.2
PE: X8.5(PE) X8.6(PE)
VFB: C38.2 D5.4(VSNS) R78.1 R79.1
NetC13_1: C13.1 C15.2 C37.1 D5.7(VIN) L3.2 R77.1
NetC43_1: C43.1 D5.8(PH) L1.1 V6.2(K)
NetC43_2: C43.2 D5.1(BOOT)
NetD5_5: D5.5(ENA) R69.1 R77.2
NetF1_2: F1.2 X9.1

Not connected (* = marked no-connect by the designer): D5 2(NC) 3(NC); X8 2(D-) 3(D+)

### Notes on the sheet
- 5V PWR
- RASPBERRYPI PWR
- MAIN PWR
- (in symbol USB-A) USB_A

### Library data of the parts
C13 C15-C21 C37 C38 C43 C46 C48 C49 = Cap: Capacitor; Value: 100pF; Published: 8-Jun-2000; LatestRevisionDate: 17-Jul-2002; LatestRevisionNote: Re-released for DXP Platform.; PackageReference: RAD-0.3; Publisher: Altium Limited; PackageDescription: Radial Cap, Thru-Hole; 2 Leads; 0.3 in Pin Spacing
D2 = D Schottky: Schottky Diode; Published: 8-Jun-2000; LatestRevisionDate: 17-Jul-2002; LatestRevisionNote: Re-released for DXP Platform.; PackageReference: SMB; Publisher: Altium Limited; PackageDescription: DO-214-AA/SMB; 2 C-Bend Leads; Body 5.3 x 3.6 mm, inc. leads (LxW); Code_JEDEC: DO-214-AA
E1 E5 = Cap Pol2: Polarized Capacitor (Axial); Published: 8-Jun-2000; LatestRevisionDate: 17-Jul-2002; LatestRevisionNote: Re-released for DXP Platform.; PackageReference: POLAR0.8; Publisher: Altium Limited; PackageDescription: Polarized Capacitor; 2 Leads
  E1: Value: 100uF,6.3V,3528
E2 E3 = Cap Pol3: as C8 on sheet FMB-MOTOR; Published: 8-Jun-2000; LatestRevisionDate: 29-May-2009; LatestRevisionNote: IPC-7351 Footprint Added.; PackageReference: C0805; Publisher: Altium Limited; PackageDescription: Chip Capacitor
F1 = Fuse 1: Fuse; Published: 8-Jun-2000; LatestRevisionDate: 17-Jul-2002; LatestRevisionNote: Re-released for DXP Platform.; PackageReference: PIN-W2/E2.8; Publisher: Altium Limited; PackageDescription: Thru-Hole; 2 Leads
L1 L3 = Inductor: Code_IEC: 1005; Value: 10mH; Published: 8-Jun-2000; LatestRevisionDate: 29-May-2009; LatestRevisionNote: IPC-7351 Footprint Added.; PackageReference: 0402-A; Publisher: Altium Limited; PackageDescription: Chip Inductor; Code_JEITA: 0402
R69 R77-R79 = Res2: Resistor; Value: 1K; Published: 8-Jun-2000; LatestRevisionDate: 17-Jul-2002; LatestRevisionNote: Re-released for DXP Platform.; PackageReference: AXIAL-0.4; Publisher: Altium Limited; PackageDescription: Axial Device, Thru-Hole; 2 Leads; 0.4 in Pin Spacing
V6 = Diode: Default Diode; Published: 8-Jun-2000; LatestRevisionDate: 17-Jul-2002; LatestRevisionNote: Re-released for DXP Platform.; PackageVersion: Sep-1996; PackageReference: SMC; Publisher: Altium Limited; PackageDescription: DO-214-AB/SMC; 2 C-Bend Leads; Body 7.9 x 5.9 mm, inc. leads (LxW); Code_JEDEC: DO-214-AB
X9 = Header 2: Header, 2-Pin; LatestRevisionDate: 17-Jul-2002; LatestRevisionNote: Re-released for DXP Platform.; Publisher: Altium Limited

## Sheet FMB-STM32.SchDoc
size A3
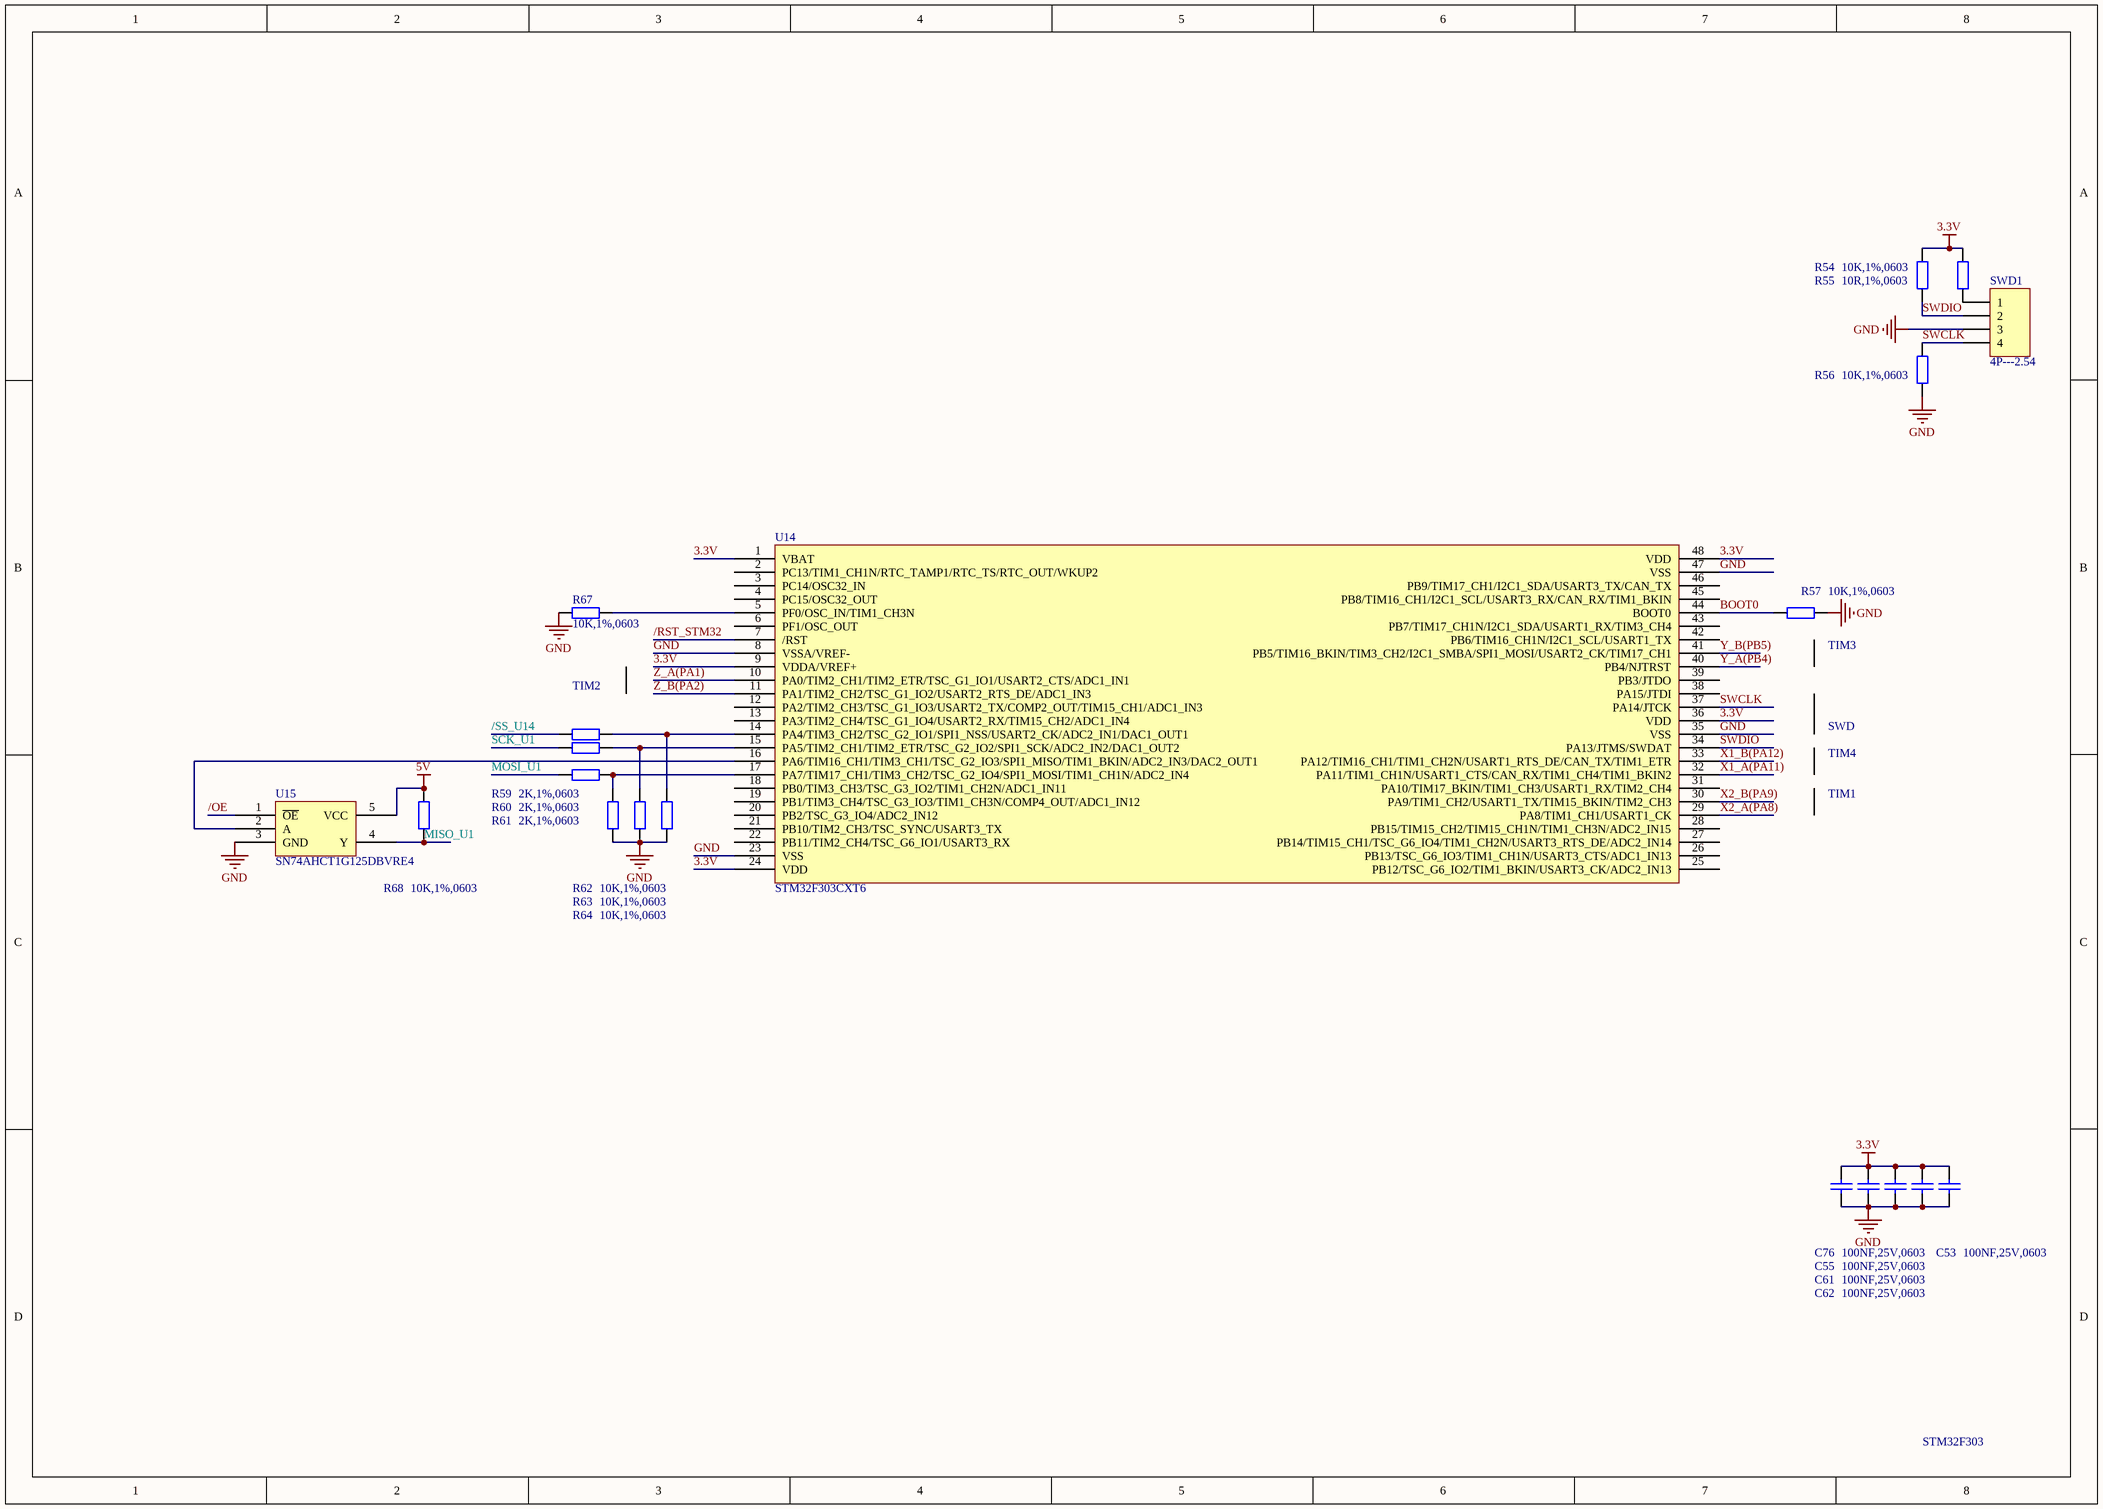
[diagram p5: FMB-STM32.SchDoc]

### Parts
C53  100NF,25V,0603  [RC0603]
C55  100NF,25V,0603  [RC0603]
C61  100NF,25V,0603  [RC0603]
C62  100NF,25V,0603  [RC0603]
C76  100NF,25V,0603  [RC0603]
R54  10K,1%,0603  [RC0603]
R55  10R,1%,0603  [RC0603]
R56  10K,1%,0603  [RC0603]
R57  10K,1%,0603  [RC0603]
R59  2K,1%,0603  [RC0603]
R60  2K,1%,0603  [RC0603]
R61  2K,1%,0603  [RC0603]
R62  10K,1%,0603  [RC0603]
R63  10K,1%,0603  [RC0603]
R64  10K,1%,0603  [RC0603]
R67  10K,1%,0603  [RC0603]
R68  10K,1%,0603  [RC0603]
SWD1  4P---2.54  [HDR1X4]
U14  STM32F303CXT6  [LQFP-48]
U15  SN74AHCT1G125DBVRE4  [SOT-23-5]

### Nets
3.3V: C53.1 C55.1 C61.1 C62.1 C76.1 R54.1 R55.1 U14.1(VBAT) U14.9(VDDA/VREF+) U14.24(VDD) U14.36(VDD) U14.48(VDD)
5V: R68.2 U15.5(VCC)
GND: C53.2 C55.2 C61.2 C62.2 C76.2 R56.1 R57.1 R62.1 R63.1 R64.1 R67.2 SWD1.3 U14.8(VSSA/VREF-) U14.23(VSS) U14.35(VSS) U14.47(VSS) U15.3(GND)
/OE: R59.1 U15.1(~{OE})  [also labelled /SS_U14]
/RST_STM32: U14.7(/RST)
BOOT0: R57.2 U14.44(BOOT0)
MISO_U1: R68.1 U15.4(Y)
MOSI_U1: R61.1
SCK_U1: R60.1
SWCLK: R56.2 SWD1.4 U14.37(PA14/JTCK)
SWDIO: R54.2 SWD1.2 U14.34(PA13/JTMS/SWDAT)
X1_A(PA11): U14.32(PA11/TIM1_CH1N/USART1_CTS/CAN_RX/TIM1_CH4/TIM1_BKIN2)
X1_B(PA12): U14.33(PA12/TIM16_CH1/TIM1_CH2N/USART1_RTS_DE/CAN_TX/TIM1_ETR)
X2_A(PA8): U14.29(PA8/TIM1_CH1/USART1_CK)
X2_B(PA9): U14.30(PA9/TIM1_CH2/USART1_TX/TIM15_BKIN/TIM2_CH3)
Y_A(PB4): U14.40(PB4/NJTRST)
Y_B(PB5): U14.41(PB5/TIM16_BKIN/TIM3_CH2/I2C1_SMBA/SPI1_MOSI/USART2_CK/TIM17_CH1)
Z_A(PA1): U14.10(PA0/TIM2_CH1/TIM2_ETR/TSC_G1_IO1/USART2_CTS/ADC1_IN1)
Z_B(PA2): U14.11(PA1/TIM2_CH2/TSC_G1_IO2/USART2_RTS_DE/ADC1_IN3)
NetR55_2: R55.2 SWD1.1
NetR59_2: R59.2 R64.2 U14.14(PA4/TIM3_CH2/TSC_G2_IO1/SPI1_NSS/USART2_CK/ADC2_IN1/DAC1_OUT1)
NetR60_2: R60.2 R63.2 U14.15(PA5/TIM2_CH1/TIM2_ETR/TSC_G2_IO2/SPI1_SCK/ADC2_IN2/DAC1_OUT2)
NetR61_2: R61.2 R62.2 U14.17(PA7/TIM17_CH1/TIM3_CH2/TSC_G2_IO4/SPI1_MOSI/TIM1_CH1N/ADC2_IN4)
NetR67_1: R67.1 U14.5(PF0/OSC_IN/TIM1_CH3N)
NetU14_16: U14.16(PA6/TIM16_CH1/TIM3_CH1/TSC_G2_IO3/SPI1_MISO/TIM1_BKIN/ADC2_IN3/DAC2_OUT1) U15.2(A)

Not connected (* = marked no-connect by the designer): U14 2(PC13/TIM1_CH1N/RTC_TAMP1/RTC_TS/RTC_OUT/WKUP2) 3(PC14/OSC32_IN) 4(PC15/OSC32_OUT) 6(PF1/OSC_OUT) 12(PA2/TIM2_CH3/TSC_G1_IO3/USART2_TX/COMP2_OUT/TIM15_CH1/ADC1_IN3) 13(PA3/TIM2_CH4/TSC_G1_IO4/USART2_RX/TIM15_CH2/ADC1_IN4) 18(PB0/TIM3_CH3/TSC_G3_IO2/TIM1_CH2N/ADC1_IN11) 19(PB1/TIM3_CH4/TSC_G3_IO3/TIM1_CH3N/COMP4_OUT/ADC1_IN12) 20(PB2/TSC_G3_IO4/ADC2_IN12) 21(PB10/TIM2_CH3/TSC_SYNC/USART3_TX) 22(PB11/TIM2_CH4/TSC_G6_IO1/USART3_RX) 25(PB12/TSC_G6_IO2/TIM1_BKIN/USART3_CK/ADC2_IN13) 26(PB13/TSC_G6_IO3/TIM1_CH1N/USART3_CTS/ADC1_IN13) 27(PB14/TIM15_CH1/TSC_G6_IO4/TIM1_CH2N/USART3_RTS_DE/ADC2_IN14) 28(PB15/TIM15_CH2/TIM15_CH1N/TIM1_CH3N/ADC2_IN15) 31(PA10/TIM17_BKIN/TIM1_CH3/USART1_RX/TIM2_CH4) 38(PA15/JTDI) 39(PB3/JTDO) 42(PB6/TIM16_CH1N/I2C1_SCL/USART1_TX) 43(PB7/TIM17_CH1N/I2C1_SDA/USART1_RX/TIM3_CH4) 45(PB8/TIM16_CH1/I2C1_SCL/USART3_RX/CAN_RX/TIM1_BKIN) 46(PB9/TIM17_CH1/I2C1_SDA/USART3_TX/CAN_TX)

### Notes on the sheet
- (near R57) TIM3
- TIM2
- SWD
- TIM4
- TIM1
- STM32F303

### Library data of the parts
C53 C55 C61 C62 C76 = Cap: Capacitor; Value: 100pF; Published: 8-Jun-2000; LatestRevisionDate: 17-Jul-2002; LatestRevisionNote: Re-released for DXP Platform.; PackageReference: RAD-0.3; Publisher: Altium Limited; PackageDescription: Radial Cap, Thru-Hole; 2 Leads; 0.3 in Pin Spacing
R54-R57 R59-R64 R67 R68 = Res2: Resistor; Value: 1K; Published: 8-Jun-2000; LatestRevisionDate: 17-Jul-2002; LatestRevisionNote: Re-released for DXP Platform.; PackageReference: AXIAL-0.4; Publisher: Altium Limited; PackageDescription: Axial Device, Thru-Hole; 2 Leads; 0.4 in Pin Spacing
SWD1 = Header 4: Header, 4-Pin; LatestRevisionDate: 17-Jul-2002; LatestRevisionNote: Re-released for DXP Platform.; Publisher: Altium Limited
U14 = STM32F303
U15 = 74AHCT1G125

## Sheet FMB-USB.SchDoc
size A4
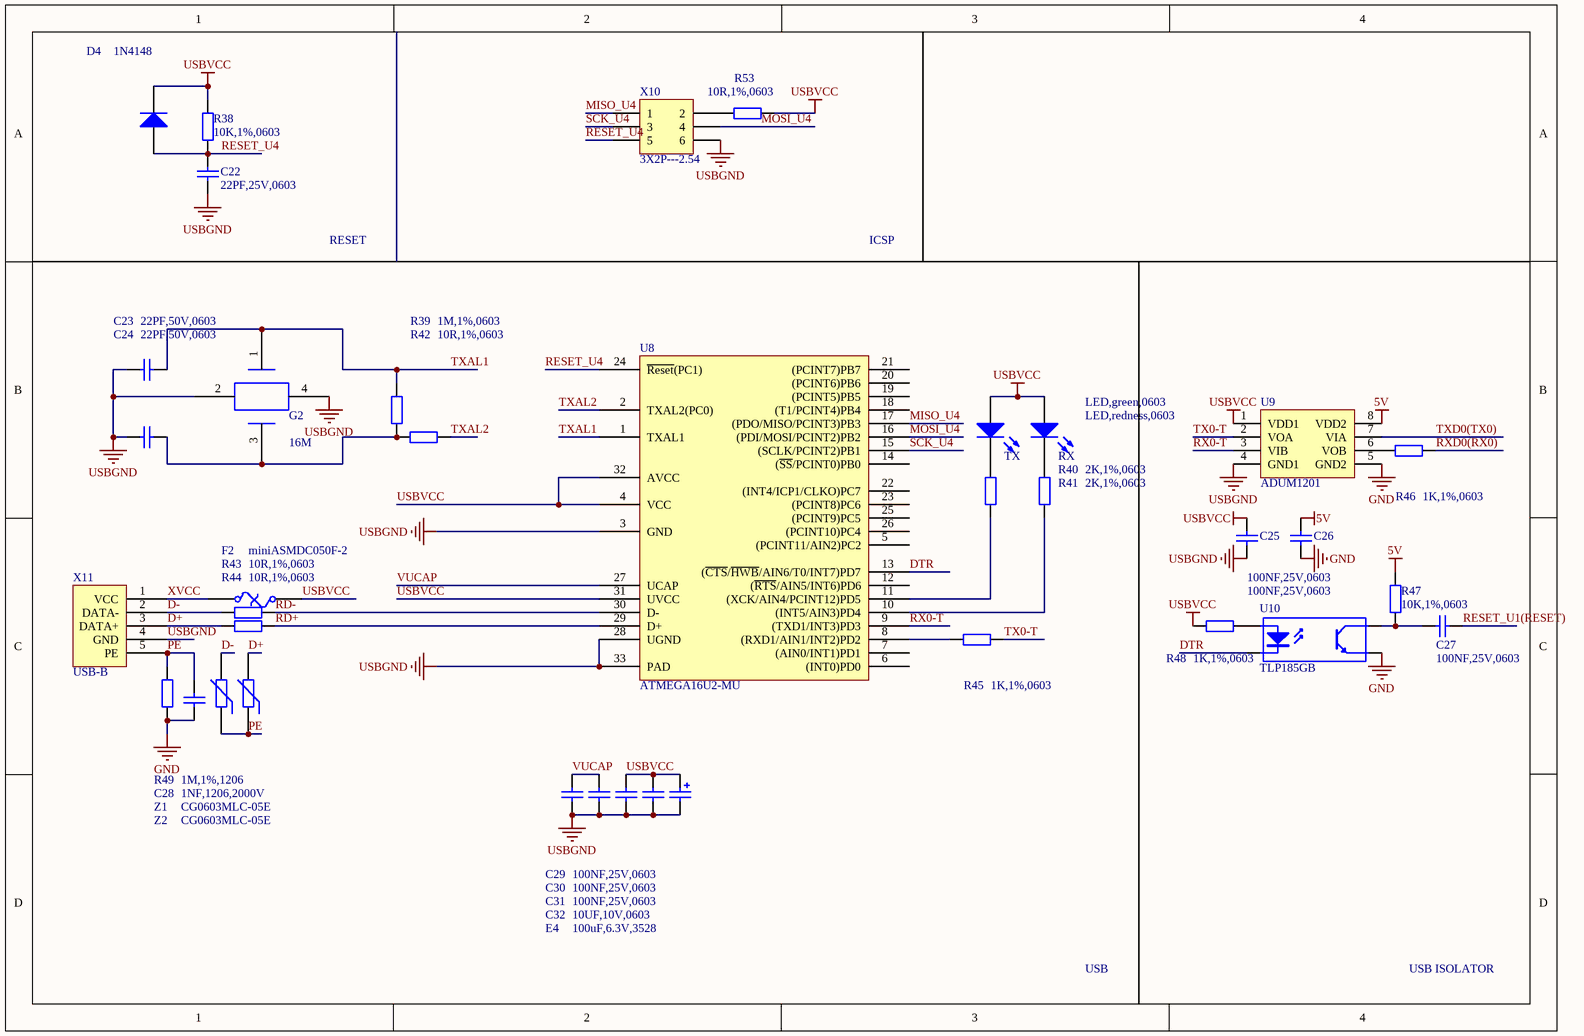
[diagram p6: FMB-USB.SchDoc]

### Parts
C22  22PF,25V,0603  [RC0603]
C23  22PF,50V,0603  [RC0603]
C24  22PF,50V,0603  [RC0603]
C25  100NF,25V,0603  [RC0603]
C26  100NF,25V,0603  [RC0603]
C27  100NF,25V,0603  [RC0603]
C28  1NF,1206,2000V  [RC1206]
C29  100NF,25V,0603  [RC0603]
C30  100NF,25V,0603  [RC0603]
C31  100NF,25V,0603  [RC0603]
C32  10UF,10V,0603  [RC0603]
D4  1N4148  [SOD-323]
E4  100uF,6.3V,3528  [3528-21]
F2  miniASMDC050F-2  [RC1812]
G2  16M  [Y-3225]
R38  10K,1%,0603  [RC0603]
R39  1M,1%,0603  [RC0603]
R40  2K,1%,0603  [RC0603]
R41  2K,1%,0603  [RC0603]
R42  10R,1%,0603  [RC0603]
R43  10R,1%,0603  [RC0603]
R44  10R,1%,0603  [RC0603]
R45  1K,1%,0603  [RC0603]
R46  1K,1%,0603  [RC0603]
R47  10K,1%,0603  [RC0603]
R48  1K,1%,0603  [RC0603]
R49  1M,1%,1206  [RC1206]
R53  10R,1%,0603  [RC0603]
RX  LED,redness,0603  [LED-0603]
TX  LED,green,0603  [LED-0603]
U8  ATMEGA16U2-MU  [QFN-32]
U9  ADUM1201  [SO-8N]
U10  TLP185GB  [SO-4]
X10  3X2P---2.54  [HDR2X3]
X11  USB-B  [USB-B180]
Z1  CG0603MLC-05E  [RC0603]
Z2  CG0603MLC-05E  [RC0603]

### Nets
5V: C26.1 R47.2 U9.8(VDD2)
GND: C26.2 C28.1 R49.1 U9.5(GND2) U10.3(E)
USBGND: C22.2 C23.2 C24.2 C25.1 C29.1 C30.1 C31.1 C32.1 E4.2 G2.2 G2.4 U8.3(GND) U8.28(UGND) U8.33(PAD) U9.4(GND1) X10.6 X11.4(GND)
USBVCC: C25.2 C31.2 C32.2 D4.2(K) E4.1 F2.2 R38.1 R48.1 R53.1 RX.1(A) TX.1(A) U8.4(VCC) U8.31(UVCC) U8.32(AVCC) U9.1(VDD1)
D+: R44.1 X11.3(DATA+) Z2.2
D-: R43.1 X11.2(DATA-) Z1.2
DTR: U8.13((~{CTS}/~{HWB}/AIN6/T0/INT7)PD7) U10.2(K)
MISO_U4: U8.17((PDO/MISO/PCINT3)PB3) X10.1
MOSI_U4: U8.16((PDI/MOSI/PCINT2)PB2) X10.4
PE: C28.2 R49.2 X11.5(PE) Z1.1 Z2.1
RD+: R44.2 U8.29(D+)
RD-: R43.2 U8.30(D-)
RESET_U1(RESET): C27.1
RESET_U4: C22.1 D4.1(A) R38.2 U8.24(~{Reset}(PC1)) X10.5
RX0-T: U8.9((TXD1/INT3)PD3) U9.3(VIB)
RXD0(RX0): R46.1
SCK_U4: U8.15((SCLK/PCINT2)PB1) X10.3
TX0-T: R45.1 U9.2(VOA)
TXAL1: C23.1 G2.1 R39.1 U8.1(TXAL1)
TXAL2: R42.2 U8.2(TXAL2(PC0))
TXD0(TX0): U9.7(VIA)
VUCAP: C29.2 C30.2 U8.27(UCAP)
XVCC: F2.1 X11.1(VCC)
NetC24_1: C24.1 G2.3 R39.2 R42.1
NetC27_2: C27.2 R47.1 U10.4(C)
NetR40_1: R40.1 TX.2(K)
NetR40_2: R40.2 U8.11((XCK/AIN4/PCINT12)PD5)
NetR41_1: R41.1 RX.2(K)
NetR41_2: R41.2 U8.10((INT5/AIN3)PD4)
NetR45_2: R45.2 U8.8((RXD1/AIN1/INT2)PD2)
NetR46_2: R46.2 U9.6(VOB)
NetR48_2: R48.2 U10.1(A)
NetR53_2: R53.2 X10.2

Not connected (* = marked no-connect by the designer): U8 5((PCINT11/AIN2)PC2) 6((INT0)PD0) 7((AIN0/INT1)PD1) 12((~{RTS}/AIN5/INT6)PD6) 14((~{SS}/PCINT0)PB0) 18((T1/PCINT4)PB4) 19((PCINT5)PB5) 20((PCINT6)PB6) 21((PCINT7)PB7) 22((INT4/ICP1/CLKO)PC7) 23((PCINT8)PC6) 25((PCINT9)PC5) 26((PCINT10)PC4)

### Notes on the sheet
- RESET
- ICSP
- USB
- USB ISOLATOR

### Library data of the parts
C22-C32 = Cap: Capacitor; Value: 100pF; Published: 8-Jun-2000; LatestRevisionDate: 17-Jul-2002; LatestRevisionNote: Re-released for DXP Platform.; PackageReference: RAD-0.3; Publisher: Altium Limited; PackageDescription: Radial Cap, Thru-Hole; 2 Leads; 0.3 in Pin Spacing
D4 = Diode: Default Diode; Published: 8-Jun-2000; LatestRevisionDate: 17-Jul-2002; LatestRevisionNote: Re-released for DXP Platform.; PackageVersion: Sep-1996; PackageReference: SMC; Publisher: Altium Limited; PackageDescription: DO-214-AB/SMC; 2 C-Bend Leads; Body 7.9 x 5.9 mm, inc. leads (LxW); Code_JEDEC: DO-214-AB
E4 = Cap Pol2: Polarized Capacitor (Axial); Published: 8-Jun-2000; LatestRevisionDate: 17-Jul-2002; LatestRevisionNote: Re-released for DXP Platform.; PackageReference: POLAR0.8; Publisher: Altium Limited; PackageDescription: Polarized Capacitor; 2 Leads; Value: 100uF,6.3V,3528
F2 = Fuse Thermal: Thermal Fuse; Published: 24-Mar-1999; LatestRevisionDate: 17-Jul-2002; LatestRevisionNote: Re-released for DXP Platform.; PackageReference: PIN-W2/E2.8; Publisher: Altium Limited; PackageDescription: Thru-Hole; 2 Leads
G2 = G
R38-R44 R47 R49 R53 = Res2: Resistor; Value: 1K; Published: 8-Jun-2000; LatestRevisionDate: 17-Jul-2002; LatestRevisionNote: Re-released for DXP Platform.; PackageReference: AXIAL-0.4; Publisher: Altium Limited; PackageDescription: Axial Device, Thru-Hole; 2 Leads; 0.4 in Pin Spacing
R45 R46 R48 = Res2: Resistor; Published: 8-Jun-2000; LatestRevisionDate: 17-Jul-2002; LatestRevisionNote: Re-released for DXP Platform.; PackageReference: AXIAL-0.4; Publisher: Altium Limited; PackageDescription: Axial Device, Thru-Hole; 2 Leads; 0.4 in Pin Spacing; Value: 1K
RX TX = LED0: Typical INFRARED GaAs LED; Published: 8-Jun-2000; LatestRevisionDate: 08-Jul-2005; LatestRevisionNote: Mech Layer 1 removed.; PackageReference: LED-0; Publisher: Altium Limited; PackageDescription: LED; 2 Leads
U8 = ATMEGA8U2-MU
U10 = Optoisolator1: 4-Pin Phototransistor Optocoupler; Published: 24-Mar-1999; LatestRevisionDate: 04-Mar-2005; LatestRevisionNote: Sch pins 3 & 4 Swapped.; DatasheetVersion: Nov-2003; PackageReference: DIP-4; Publisher: Altium Limited
X10 = Header 3X2: Header, 3-Pin, Dual row; LatestRevisionDate: 17-Jul-2002; LatestRevisionNote: Re-released for DXP Platform.; Publisher: Altium Limited
X11 = B-USC
Z1 Z2 = Res Varistor: Varistor (Voltage-Sensitive Resistor); Published: 24-Mar-1999; LatestRevisionDate: 29-May-2009; LatestRevisionNote: IPC-7351 Footprint Added.; PackageVersion: Mar-2003; PackageReference: 6-0805; Publisher: Altium Limited; PackageDescription: Chip Resistor 0805 Case Size; Code_IPC: RESC2012

## Nets that join several sheets
3.3V: FMB-MCU (R58.1), FMB-POWER (6 pins), FMB-STM32 (12 pins)
5V: FMB_MOS (17 pins), FMB-AB (15 pins), FMB-MCU (22 pins), FMB-MOTOR (25 pins), FMB-POWER (9 pins), FMB-STM32 (R68.2 U15.5), FMB-USB (C26.1 R47.2 U9.8)
24V: FMB_MOS (15 pins), FMB-MOTOR (10 pins), FMB-POWER (8 pins)
GND: FMB_MOS (32 pins), FMB-AB (30 pins), FMB-MCU (27 pins), FMB-MOTOR (25 pins), FMB-POWER (25 pins), FMB-STM32 (17 pins), FMB-USB (5 pins)
/OE: FMB-MCU (R66.1 U1.78), FMB-STM32 (R59.1 U15.1)
/RST_STM32: FMB-MCU (C75.2 D3.1 R58.2), FMB-STM32 (U14.7)
AUX_DIR(D41): FMB-MCU (U1.51), FMB-MOTOR (U3.8)
AUX_EN(D37): FMB-MCU (U1.53), FMB-MOTOR (R26.2 U3.1)
AUX_STEP(D40): FMB-MCU (U1.52), FMB-MOTOR (R51.1 U3.7)
D4: FMB_MOS (P6.7), FMB-MCU (U1.1)
D5: FMB_MOS (P6.5), FMB-MCU (U1.5)
D6: FMB_MOS (P6.3), FMB-MCU (U1.15)
D11: FMB_MOS (P6.1), FMB-MCU (U1.24)
Lighting(D7): FMB_MOS (R6.1), FMB-MCU (U1.16)
MISO_U1: FMB-MCU (P1.3 U1.22 X12.1), FMB-STM32 (R68.1 U15.4)
MOSI_U1: FMB-MCU (P1.4 U1.21 X12.4), FMB-STM32 (R61.1)
PE: FMB-AB (P8.1 P9.1 P10.1 P11.1), FMB-POWER (X8.5 X8.6), FMB-USB (5 pins)
Periph4(D10): FMB_MOS (R9.1), FMB-MCU (U1.23)
Periph5(D12): FMB_MOS (R10.1), FMB-MCU (U1.25)
RESET_U1(RESET): FMB-MCU (6 pins), FMB-USB (C27.1)
RXD0(RX0): FMB-MCU (U1.2), FMB-USB (R46.1)
SCK_U1: FMB-MCU (P1.5 U1.20 X12.3), FMB-STM32 (R60.1)
SCL(D21): FMB_MOS (P3.4 R16.1), FMB-MCU (U1.43)
SDA(D20): FMB_MOS (P3.3 R17.1), FMB-MCU (U1.44)
TXD0(TX0): FMB-MCU (U1.3), FMB-USB (U9.7)
Vacuum(D9): FMB_MOS (R8.1), FMB-MCU (U1.18)
Water(D8): FMB_MOS (R7.1), FMB-MCU (U1.17)
X1_A(PA11): FMB-AB (C52.2 RP5.6), FMB-STM32 (U14.32)
X1_B(PA12): FMB-AB (C54.2 RP5.5), FMB-STM32 (U14.33)
X1_DIR(D27): FMB-MCU (U1.73), FMB-MOTOR (U4.8)
X1_EN(D25): FMB-MCU (U1.75), FMB-MOTOR (R29.2 U4.1)
X1_STEP(D26): FMB-MCU (U1.74), FMB-MOTOR (R22.1 U4.7)
X2_A(PA8): FMB-AB (C57.2 RP5.8), FMB-STM32 (U14.29)
X2_B(PA9): FMB-AB (C56.2 RP5.7), FMB-STM32 (U14.30)
X2_DIR(D30): FMB-MCU (U1.60), FMB-MOTOR (U2.8)
X2_EN(D14): FMB-MCU (U1.64), FMB-MOTOR (R25.2 U2.1)
X2_STEP(D15): FMB-MCU (U1.63), FMB-MOTOR (R35.1 U2.7)
X-MAX(A14): FMB_MOS (P5.4), FMB-MCU (U1.83)
X-MIN(A15): FMB_MOS (P5.2), FMB-MCU (U1.82)
Y-MAX(A12): FMB_MOS (P5.8), FMB-MCU (U1.85)
Y-MIN(A13): FMB_MOS (P5.6), FMB-MCU (U1.84)
Y_A(PB4): FMB-AB (C39.2 RP2.6), FMB-STM32 (U14.40)
Y_B(PB5): FMB-AB (C40.2 RP2.5), FMB-STM32 (U14.41)
Y_DIR(D33): FMB-MCU (U1.57), FMB-MOTOR (U5.8)
Y_EN(D31): FMB-MCU (U1.59), FMB-MOTOR (R30.2 U5.1)
Y_STEP(D32): FMB-MCU (U1.58), FMB-MOTOR (R36.1 U5.7)
Z-MAX(A10): FMB_MOS (P5.12), FMB-MCU (U1.87)
Z-MIN(A11): FMB_MOS (P5.10), FMB-MCU (U1.86)
Z_A(PA1): FMB-AB (C42.2 RP2.8), FMB-STM32 (U14.10)
Z_B(PA2): FMB-AB (C41.2 RP2.7), FMB-STM32 (U14.11)
Z_DIR(D36): FMB-MCU (U1.54), FMB-MOTOR (U6.8)
Z_EN(D34): FMB-MCU (U1.56), FMB-MOTOR (R31.2 U6.1)
Z_STEP(D35): FMB-MCU (U1.55), FMB-MOTOR (R37.1 U6.7)